# EAGLE design IO-Board (EAGLE 7.4.0)

## Sheet 1 of 5: Verbinder
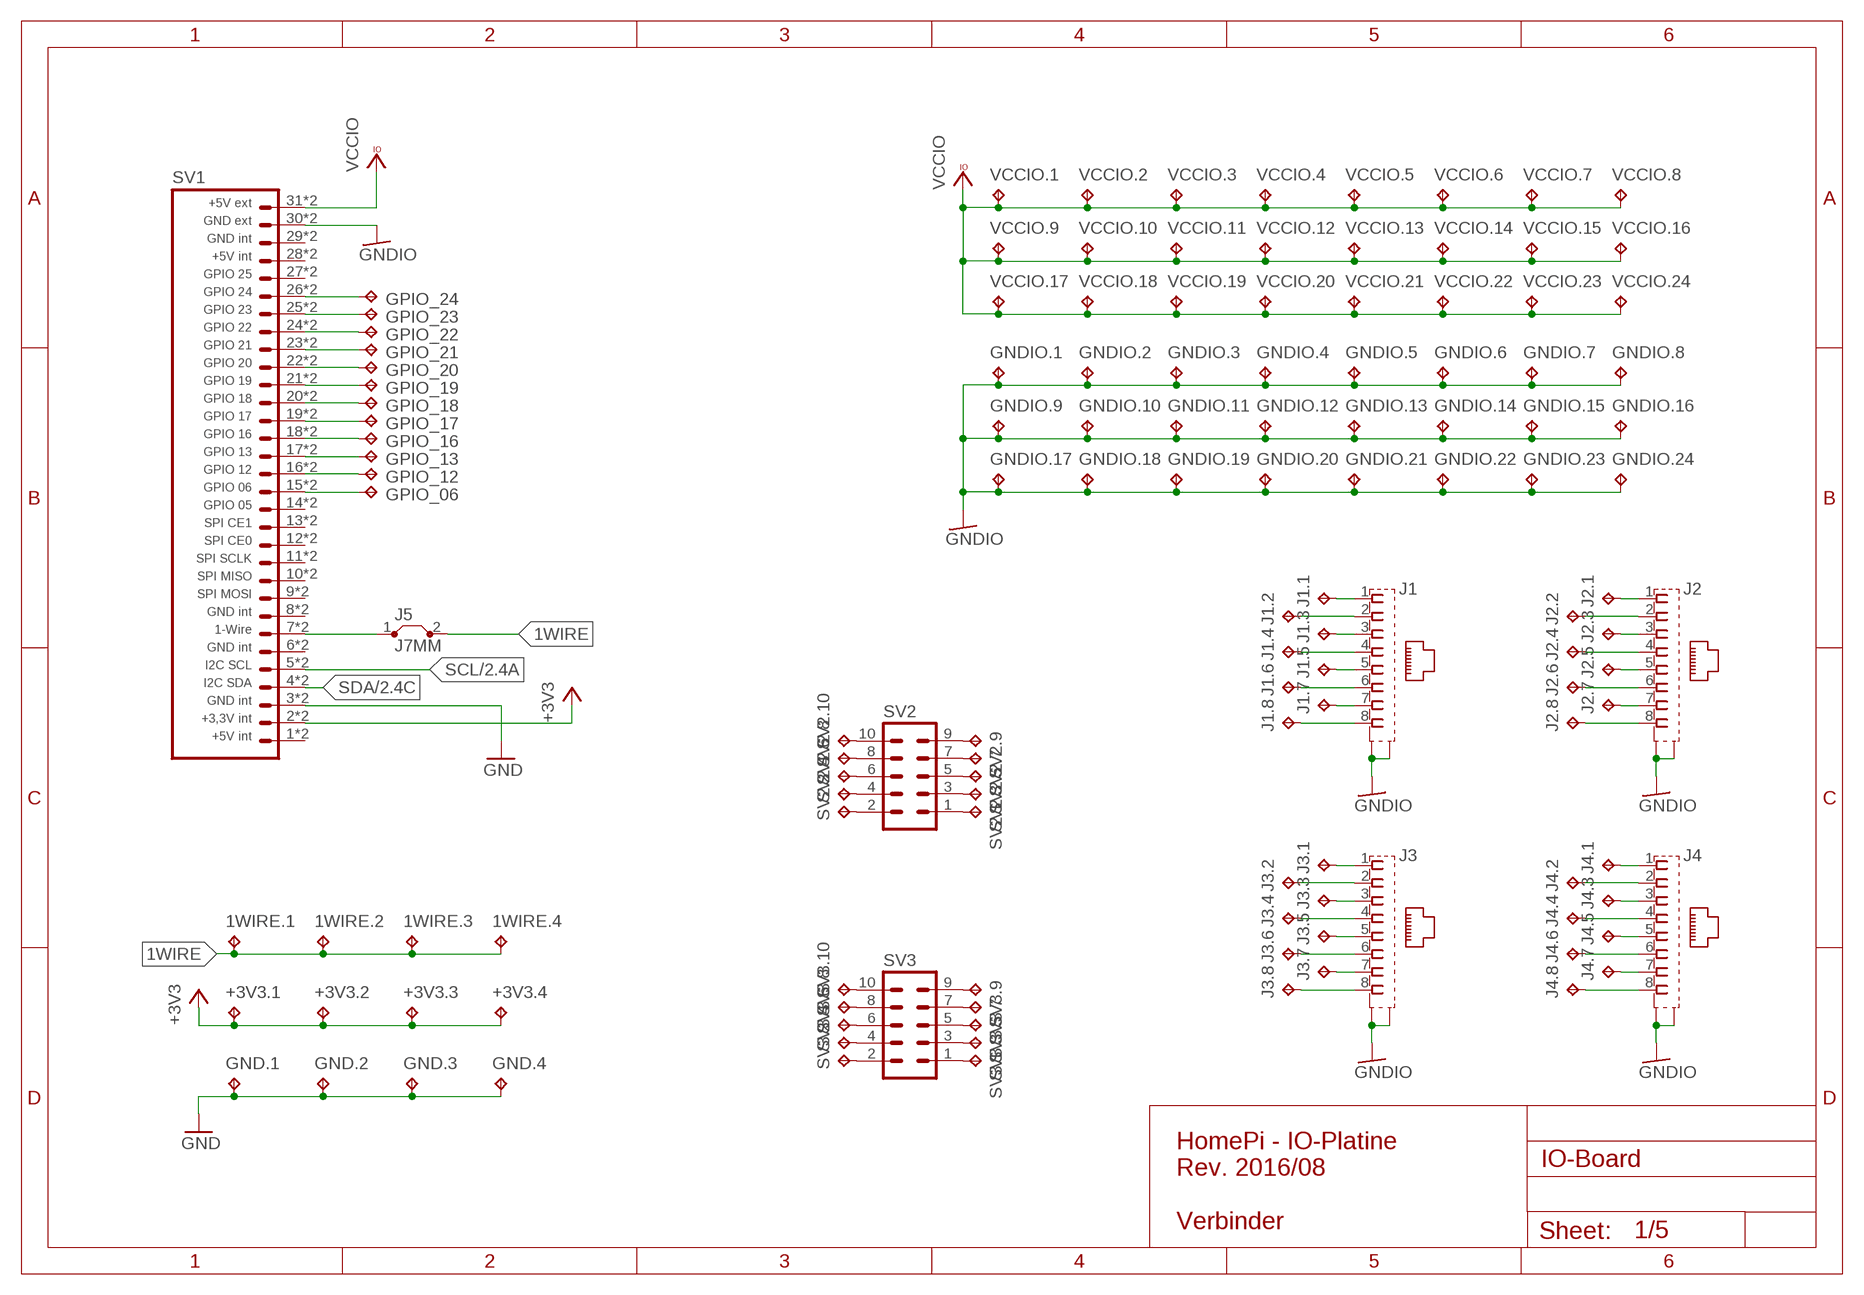
[diagram p0: schematic, sheet 1]

### Parts
1WIRE.1  TPPAD1-13  [P1-13]
1WIRE.2  TPPAD1-13  [P1-13]
1WIRE.3  TPPAD1-13  [P1-13]
1WIRE.4  TPPAD1-13  [P1-13]
+3V3.1  TPPAD1-13  [P1-13]
+3V3.2  TPPAD1-13  [P1-13]
+3V3.3  TPPAD1-13  [P1-13]
+3V3.4  TPPAD1-13  [P1-13]
GND.1  TPPAD1-13  [P1-13]
GND.2  TPPAD1-13  [P1-13]
GND.3  TPPAD1-13  [P1-13]
GND.4  TPPAD1-13  [P1-13]
GNDIO.1  TPPAD1-13  [P1-13]
GNDIO.2  TPPAD1-13  [P1-13]
GNDIO.3  TPPAD1-13  [P1-13]
GNDIO.4  TPPAD1-13  [P1-13]
GNDIO.5  TPPAD1-13  [P1-13]
GNDIO.6  TPPAD1-13  [P1-13]
GNDIO.7  TPPAD1-13  [P1-13]
GNDIO.8  TPPAD1-13  [P1-13]
GNDIO.9  TPPAD1-13  [P1-13]
GNDIO.10  TPPAD1-13  [P1-13]
GNDIO.11  TPPAD1-13  [P1-13]
GNDIO.12  TPPAD1-13  [P1-13]
GNDIO.13  TPPAD1-13  [P1-13]
GNDIO.14  TPPAD1-13  [P1-13]
GNDIO.15  TPPAD1-13  [P1-13]
GNDIO.16  TPPAD1-13  [P1-13]
GNDIO.17  TPPAD1-13  [P1-13]
GNDIO.18  TPPAD1-13  [P1-13]
GNDIO.19  TPPAD1-13  [P1-13]
GNDIO.20  TPPAD1-13  [P1-13]
GNDIO.21  TPPAD1-13  [P1-13]
GNDIO.22  TPPAD1-13  [P1-13]
GNDIO.23  TPPAD1-13  [P1-13]
GNDIO.24  TPPAD1-13  [P1-13]
GPIO_06  TPPAD1-13  [P1-13]
GPIO_12  TPPAD1-13  [P1-13]
GPIO_13  TPPAD1-13  [P1-13]
GPIO_16  TPPAD1-13  [P1-13]
GPIO_17  TPPAD1-13  [P1-13]
GPIO_18  TPPAD1-13  [P1-13]
GPIO_19  TPPAD1-13  [P1-13]
GPIO_20  TPPAD1-13  [P1-13]
GPIO_21  TPPAD1-13  [P1-13]
GPIO_22  TPPAD1-13  [P1-13]
GPIO_23  TPPAD1-13  [P1-13]
GPIO_24  TPPAD1-13  [P1-13]
J1  555141-1  [555153-1]
J1.1  TPPAD1-13  [P1-13]
J1.2  TPPAD1-13  [P1-13]
J1.3  TPPAD1-13  [P1-13]
J1.4  TPPAD1-13  [P1-13]
J1.5  TPPAD1-13  [P1-13]
J1.6  TPPAD1-13  [P1-13]
J1.7  TPPAD1-13  [P1-13]
J1.8  TPPAD1-13  [P1-13]
J2  555141-1  [555153-1]
J2.1  TPPAD1-13  [P1-13]
J2.2  TPPAD1-13  [P1-13]
J2.3  TPPAD1-13  [P1-13]
J2.4  TPPAD1-13  [P1-13]
J2.5  TPPAD1-13  [P1-13]
J2.6  TPPAD1-13  [P1-13]
J2.7  TPPAD1-13  [P1-13]
J2.8  TPPAD1-13  [P1-13]
J3  555141-1  [555153-1]
J3.1  TPPAD1-13  [P1-13]
J3.2  TPPAD1-13  [P1-13]
J3.3  TPPAD1-13  [P1-13]
J3.4  TPPAD1-13  [P1-13]
J3.5  TPPAD1-13  [P1-13]
J3.6  TPPAD1-13  [P1-13]
J3.7  TPPAD1-13  [P1-13]
J3.8  TPPAD1-13  [P1-13]
J4  555141-1  [555153-1]
J4.1  TPPAD1-13  [P1-13]
J4.2  TPPAD1-13  [P1-13]
J4.3  TPPAD1-13  [P1-13]
J4.4  TPPAD1-13  [P1-13]
J4.5  TPPAD1-13  [P1-13]
J4.6  TPPAD1-13  [P1-13]
J4.7  TPPAD1-13  [P1-13]
J4.8  TPPAD1-13  [P1-13]
J5  J7MM  [07]
SV1  PLATINENVERBINDER-31SMD  [PLATINENVERBINDER-31-SMD]
SV2  ML10  [ML10]
SV2.1  TPPAD1-13  [P1-13]
SV2.2  TPPAD1-13  [P1-13]
SV2.3  TPPAD1-13  [P1-13]
SV2.4  TPPAD1-13  [P1-13]
SV2.5  TPPAD1-13  [P1-13]
SV2.6  TPPAD1-13  [P1-13]
SV2.7  TPPAD1-13  [P1-13]
SV2.8  TPPAD1-13  [P1-13]
SV2.9  TPPAD1-13  [P1-13]
SV2.10  TPPAD1-13  [P1-13]
SV3  ML10  [ML10]
SV3.1  TPPAD1-13  [P1-13]
SV3.2  TPPAD1-13  [P1-13]
SV3.3  TPPAD1-13  [P1-13]
SV3.4  TPPAD1-13  [P1-13]
SV3.5  TPPAD1-13  [P1-13]
SV3.6  TPPAD1-13  [P1-13]
SV3.7  TPPAD1-13  [P1-13]
SV3.8  TPPAD1-13  [P1-13]
SV3.9  TPPAD1-13  [P1-13]
SV3.10  TPPAD1-13  [P1-13]
VCCIO.1  TPPAD1-13  [P1-13]
VCCIO.2  TPPAD1-13  [P1-13]
VCCIO.3  TPPAD1-13  [P1-13]
VCCIO.4  TPPAD1-13  [P1-13]
VCCIO.5  TPPAD1-13  [P1-13]
VCCIO.6  TPPAD1-13  [P1-13]
VCCIO.7  TPPAD1-13  [P1-13]
VCCIO.8  TPPAD1-13  [P1-13]
VCCIO.9  TPPAD1-13  [P1-13]
VCCIO.10  TPPAD1-13  [P1-13]
VCCIO.11  TPPAD1-13  [P1-13]
VCCIO.12  TPPAD1-13  [P1-13]
VCCIO.13  TPPAD1-13  [P1-13]
VCCIO.14  TPPAD1-13  [P1-13]
VCCIO.15  TPPAD1-13  [P1-13]
VCCIO.16  TPPAD1-13  [P1-13]
VCCIO.17  TPPAD1-13  [P1-13]
VCCIO.18  TPPAD1-13  [P1-13]
VCCIO.19  TPPAD1-13  [P1-13]
VCCIO.20  TPPAD1-13  [P1-13]
VCCIO.21  TPPAD1-13  [P1-13]
VCCIO.22  TPPAD1-13  [P1-13]
VCCIO.23  TPPAD1-13  [P1-13]
VCCIO.24  TPPAD1-13  [P1-13]

### Nets
1WIRE: 1WIRE.1.TP 1WIRE.2.TP 1WIRE.3.TP 1WIRE.4.TP J5.2
+3V3: +3V3.1.TP +3V3.2.TP +3V3.3.TP +3V3.4.TP SV1.2 SV1.2T ; also sheet 2,3,4
GND: GND.1.TP GND.2.TP GND.3.TP GND.4.TP SV1.3 SV1.3T ; also sheet 2,5
GNDIO: GNDIO.1.TP GNDIO.2.TP GNDIO.3.TP GNDIO.4.TP GNDIO.5.TP GNDIO.6.TP GNDIO.7.TP GNDIO.8.TP GNDIO.9.TP GNDIO.10.TP GNDIO.11.TP GNDIO.12.TP GNDIO.13.TP GNDIO.14.TP GNDIO.15.TP GNDIO.16.TP GNDIO.17.TP GNDIO.18.TP GNDIO.19.TP GNDIO.20.TP GNDIO.21.TP GNDIO.22.TP GNDIO.23.TP GNDIO.24.TP J1.G1(S1) J1.G2(S2) J2.G1(S1) J2.G2(S2) J3.G1(S1) J3.G2(S2) J4.G1(S1) J4.G2(S2) SV1.30 SV1.30T ; also sheet 3,4
N$36: J1.1 J1.1.TP
N$37: J1.2 J1.2.TP
N$38: J1.3 J1.3.TP
N$39: J1.4 J1.4.TP
N$40: J1.5 J1.5.TP
N$41: J1.6 J1.6.TP
N$42: J1.7 J1.7.TP
N$43: J1.8 J1.8.TP
N$44: J2.1 J2.1.TP
N$45: J2.2 J2.2.TP
N$46: J2.3 J2.3.TP
N$47: J2.4 J2.4.TP
N$48: J2.5 J2.5.TP
N$49: J2.6 J2.6.TP
N$50: J2.7 J2.7.TP
N$51: J2.8 J2.8.TP
N$129: J3.1 J3.1.TP
N$130: J3.2 J3.2.TP
N$131: J3.3 J3.3.TP
N$132: J3.4 J3.4.TP
N$133: J3.5 J3.5.TP
N$134: J3.6 J3.6.TP
N$135: J3.7 J3.7.TP
N$136: J3.8 J3.8.TP
N$137: J4.1 J4.1.TP
N$138: J4.2 J4.2.TP
N$139: J4.3 J4.3.TP
N$140: J4.4 J4.4.TP
N$141: J4.5 J4.5.TP
N$142: J4.6 J4.6.TP
N$143: J4.7 J4.7.TP
N$144: J4.8 J4.8.TP
N$145: J5.1 SV1.7 SV1.7T
N$146: GPIO_23.TP SV1.25 SV1.25T
N$147: GPIO_22.TP SV1.24 SV1.24T
N$148: GPIO_21.TP SV1.23 SV1.23T
N$149: GPIO_20.TP SV1.22 SV1.22T
N$150: GPIO_19.TP SV1.21 SV1.21T
N$151: GPIO_18.TP SV1.20 SV1.20T
N$152: GPIO_17.TP SV1.19 SV1.19T
N$153: GPIO_16.TP SV1.18 SV1.18T
N$154: GPIO_13.TP SV1.17 SV1.17T
N$155: GPIO_12.TP SV1.16 SV1.16T
N$156: GPIO_06.TP SV1.15 SV1.15T
N$157: SV2.1 SV2.1.TP
N$158: SV2.2 SV2.2.TP
N$159: SV2.3 SV2.3.TP
N$160: SV2.4 SV2.4.TP
N$161: SV2.5 SV2.5.TP
N$162: SV2.6 SV2.6.TP
N$163: SV2.7 SV2.7.TP
N$164: SV2.8 SV2.8.TP
N$165: SV2.9 SV2.9.TP
N$166: SV2.10 SV2.10.TP
N$167: SV3.1 SV3.1.TP
N$168: SV3.2 SV3.2.TP
N$169: SV3.3 SV3.3.TP
N$170: SV3.4 SV3.4.TP
N$171: SV3.5 SV3.5.TP
N$172: SV3.6 SV3.6.TP
N$173: SV3.7 SV3.7.TP
N$174: SV3.8 SV3.8.TP
N$175: SV3.9 SV3.9.TP
N$176: SV3.10 SV3.10.TP
N$177: GPIO_24.TP SV1.26 SV1.26T
SCL: SV1.5 SV1.5T ; also sheet 2
SDA: SV1.4 SV1.4T ; also sheet 2
VCCIO: SV1.31 SV1.31T VCCIO.1.TP VCCIO.2.TP VCCIO.3.TP VCCIO.4.TP VCCIO.5.TP VCCIO.6.TP VCCIO.7.TP VCCIO.8.TP VCCIO.9.TP VCCIO.10.TP VCCIO.11.TP VCCIO.12.TP VCCIO.13.TP VCCIO.14.TP VCCIO.15.TP VCCIO.16.TP VCCIO.17.TP VCCIO.18.TP VCCIO.19.TP VCCIO.20.TP VCCIO.21.TP VCCIO.22.TP VCCIO.23.TP VCCIO.24.TP ; also sheet 3,4,5
Unconnected: SV1.1 SV1.1T SV1.6 SV1.6T SV1.8 SV1.8T SV1.9 SV1.9T SV1.10 SV1.10T SV1.11 SV1.11T SV1.12 SV1.12T SV1.13 SV1.13T SV1.14 SV1.14T SV1.27 SV1.27T SV1.28 SV1.28T SV1.29 SV1.29T

### Notes on the sheet
- HomePi - IO-Platine
  Rev. 2016/08
  
  Verbinder

## Sheet 2 of 5: ICs
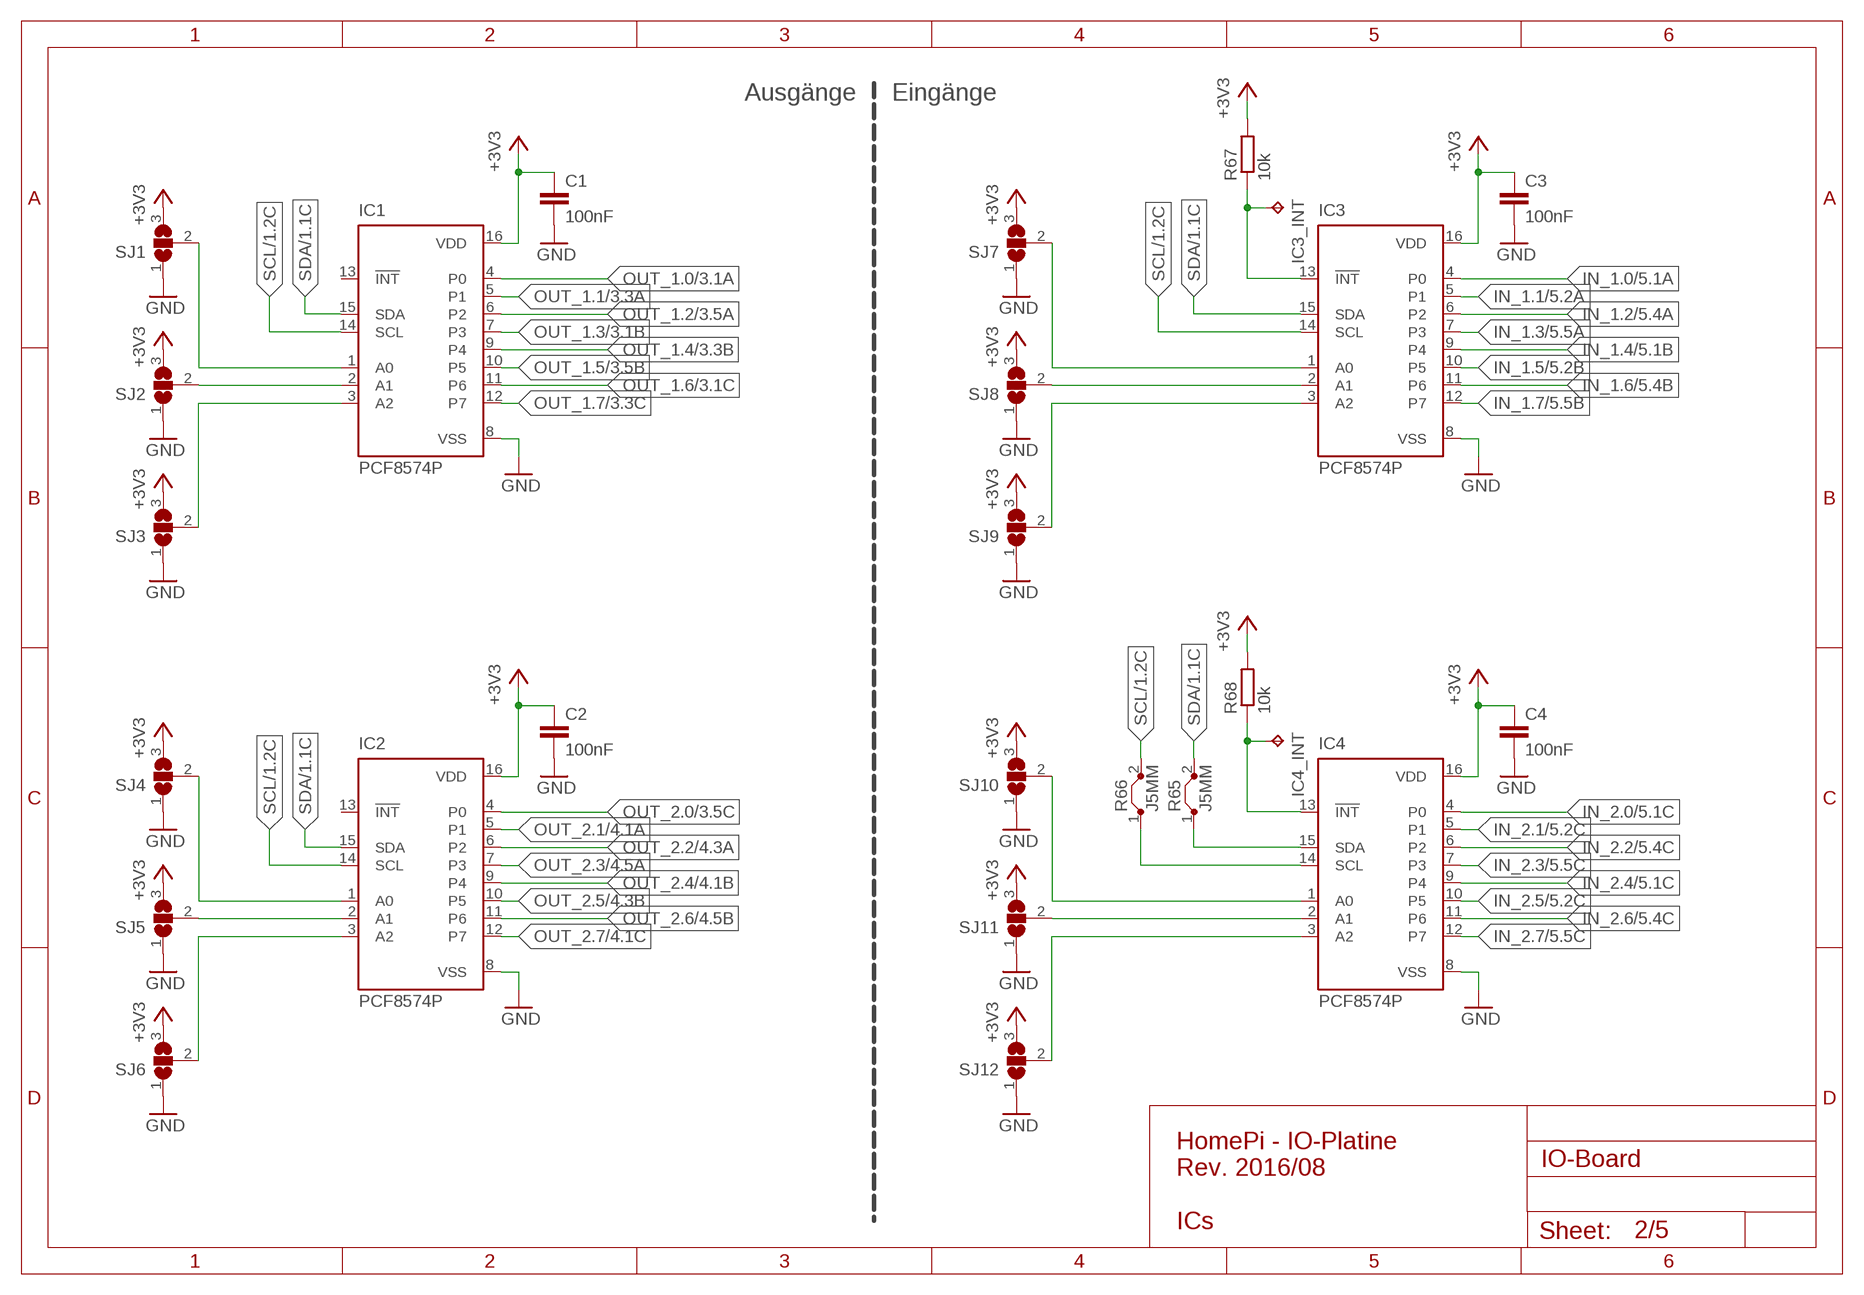
[diagram p1: schematic, sheet 2]

### Parts
C1  100nF  C-EU025-025X050  [C025-025X050]
C2  100nF  C-EU025-025X050  [C025-025X050]
C3  100nF  C-EU025-025X050  [C025-025X050]
C4  100nF  C-EU025-025X050  [C025-025X050]
IC1  PCF8574P  [DIL16]
IC2  PCF8574P  [DIL16]
IC3  PCF8574P  [DIL16]
IC3_INT  TPPAD1-13  [P1-13]
IC4  PCF8574P  [DIL16]
IC4_INT  TPPAD1-13  [P1-13]
R65  J5MM  [05]
R66  J5MM  [05]
R67  10k  R-EU_0204/2V  [0204V]
R68  10k  R-EU_0204/2V  [0204V]
SJ1  SJ2W  [SJ_2]
SJ2  SJ2W  [SJ_2]
SJ3  SJ2W  [SJ_2]
SJ4  SJ2W  [SJ_2]
SJ5  SJ2W  [SJ_2]
SJ6  SJ2W  [SJ_2]
SJ7  SJ2W  [SJ_2]
SJ8  SJ2W  [SJ_2]
SJ9  SJ2W  [SJ_2]
SJ10  SJ2W  [SJ_2]
SJ11  SJ2W  [SJ_2]
SJ12  SJ2W  [SJ_2]

### Nets
+3V3: C1.1 C2.1 C3.1 C4.1 IC1.16(VDD) IC2.16(VDD) IC3.16(VDD) IC4.16(VDD) R67.2 R68.2 SJ1.3 SJ2.3 SJ3.3 SJ4.3 SJ5.3 SJ6.3 SJ7.3 SJ8.3 SJ9.3 SJ10.3 SJ11.3 SJ12.3 ; also sheet 1,3,4
GND: C1.2 C2.2 C3.2 C4.2 IC1.8(VSS) IC2.8(VSS) IC3.8(VSS) IC4.8(VSS) SJ1.1 SJ2.1 SJ3.1 SJ4.1 SJ5.1 SJ6.1 SJ7.1 SJ8.1 SJ9.1 SJ10.1 SJ11.1 SJ12.1 ; also sheet 1,5
IN_1.0: IC3.4(P0) ; also sheet 5
IN_1.1: IC3.5(P1) ; also sheet 5
IN_1.2: IC3.6(P2) ; also sheet 5
IN_1.3: IC3.7(P3) ; also sheet 5
IN_1.4: IC3.9(P4) ; also sheet 5
IN_1.5: IC3.10(P5) ; also sheet 5
IN_1.6: IC3.11(P6) ; also sheet 5
IN_1.7: IC3.12(P7) ; also sheet 5
IN_2.0: IC4.4(P0) ; also sheet 5
IN_2.1: IC4.5(P1) ; also sheet 5
IN_2.2: IC4.6(P2) ; also sheet 5
IN_2.3: IC4.7(P3) ; also sheet 5
IN_2.4: IC4.9(P4) ; also sheet 5
IN_2.5: IC4.10(P5) ; also sheet 5
IN_2.6: IC4.11(P6) ; also sheet 5
IN_2.7: IC4.12(P7) ; also sheet 5
N$1: IC1.1(A0) SJ1.2
N$2: IC1.2(A1) SJ2.2
N$3: IC1.3(A2) SJ3.2
N$84: IC2.1(A0) SJ4.2
N$85: IC2.2(A1) SJ5.2
N$86: IC2.3(A2) SJ6.2
N$87: IC3.1(A0) SJ7.2
N$88: IC3.2(A1) SJ8.2
N$89: IC3.3(A2) SJ9.2
N$106: IC3.13(!INT) IC3_INT.TP R67.1
N$107: IC4.1(A0) SJ10.2
N$108: IC4.2(A1) SJ11.2
N$109: IC4.3(A2) SJ12.2
N$126: IC4.13(!INT) IC4_INT.TP R68.1
N$127: IC4.15(SDA) R65.1
N$128: IC4.14(SCL) R66.1
OUT_1.0: IC1.4(P0) ; also sheet 3
OUT_1.1: IC1.5(P1) ; also sheet 3
OUT_1.2: IC1.6(P2) ; also sheet 3
OUT_1.3: IC1.7(P3) ; also sheet 3
OUT_1.4: IC1.9(P4) ; also sheet 3
OUT_1.5: IC1.10(P5) ; also sheet 3
OUT_1.6: IC1.11(P6) ; also sheet 3
OUT_1.7: IC1.12(P7) ; also sheet 3
OUT_2.0: IC2.4(P0) ; also sheet 3
OUT_2.1: IC2.5(P1) ; also sheet 4
OUT_2.2: IC2.6(P2) ; also sheet 4
OUT_2.3: IC2.7(P3) ; also sheet 4
OUT_2.4: IC2.9(P4) ; also sheet 4
OUT_2.5: IC2.10(P5) ; also sheet 4
OUT_2.6: IC2.11(P6) ; also sheet 4
OUT_2.7: IC2.12(P7) ; also sheet 4
SCL: IC1.14(SCL) IC2.14(SCL) IC3.14(SCL) R66.2 ; also sheet 1
SDA: IC1.15(SDA) IC2.15(SDA) IC3.15(SDA) R65.2 ; also sheet 1
Unconnected: IC1.13(!INT) IC2.13(!INT)

### Notes on the sheet
- Ausgänge | Eingänge
- HomePi - IO-Platine
  Rev. 2016/08
  
  ICs

## Sheet 3 of 5: Ausgänge
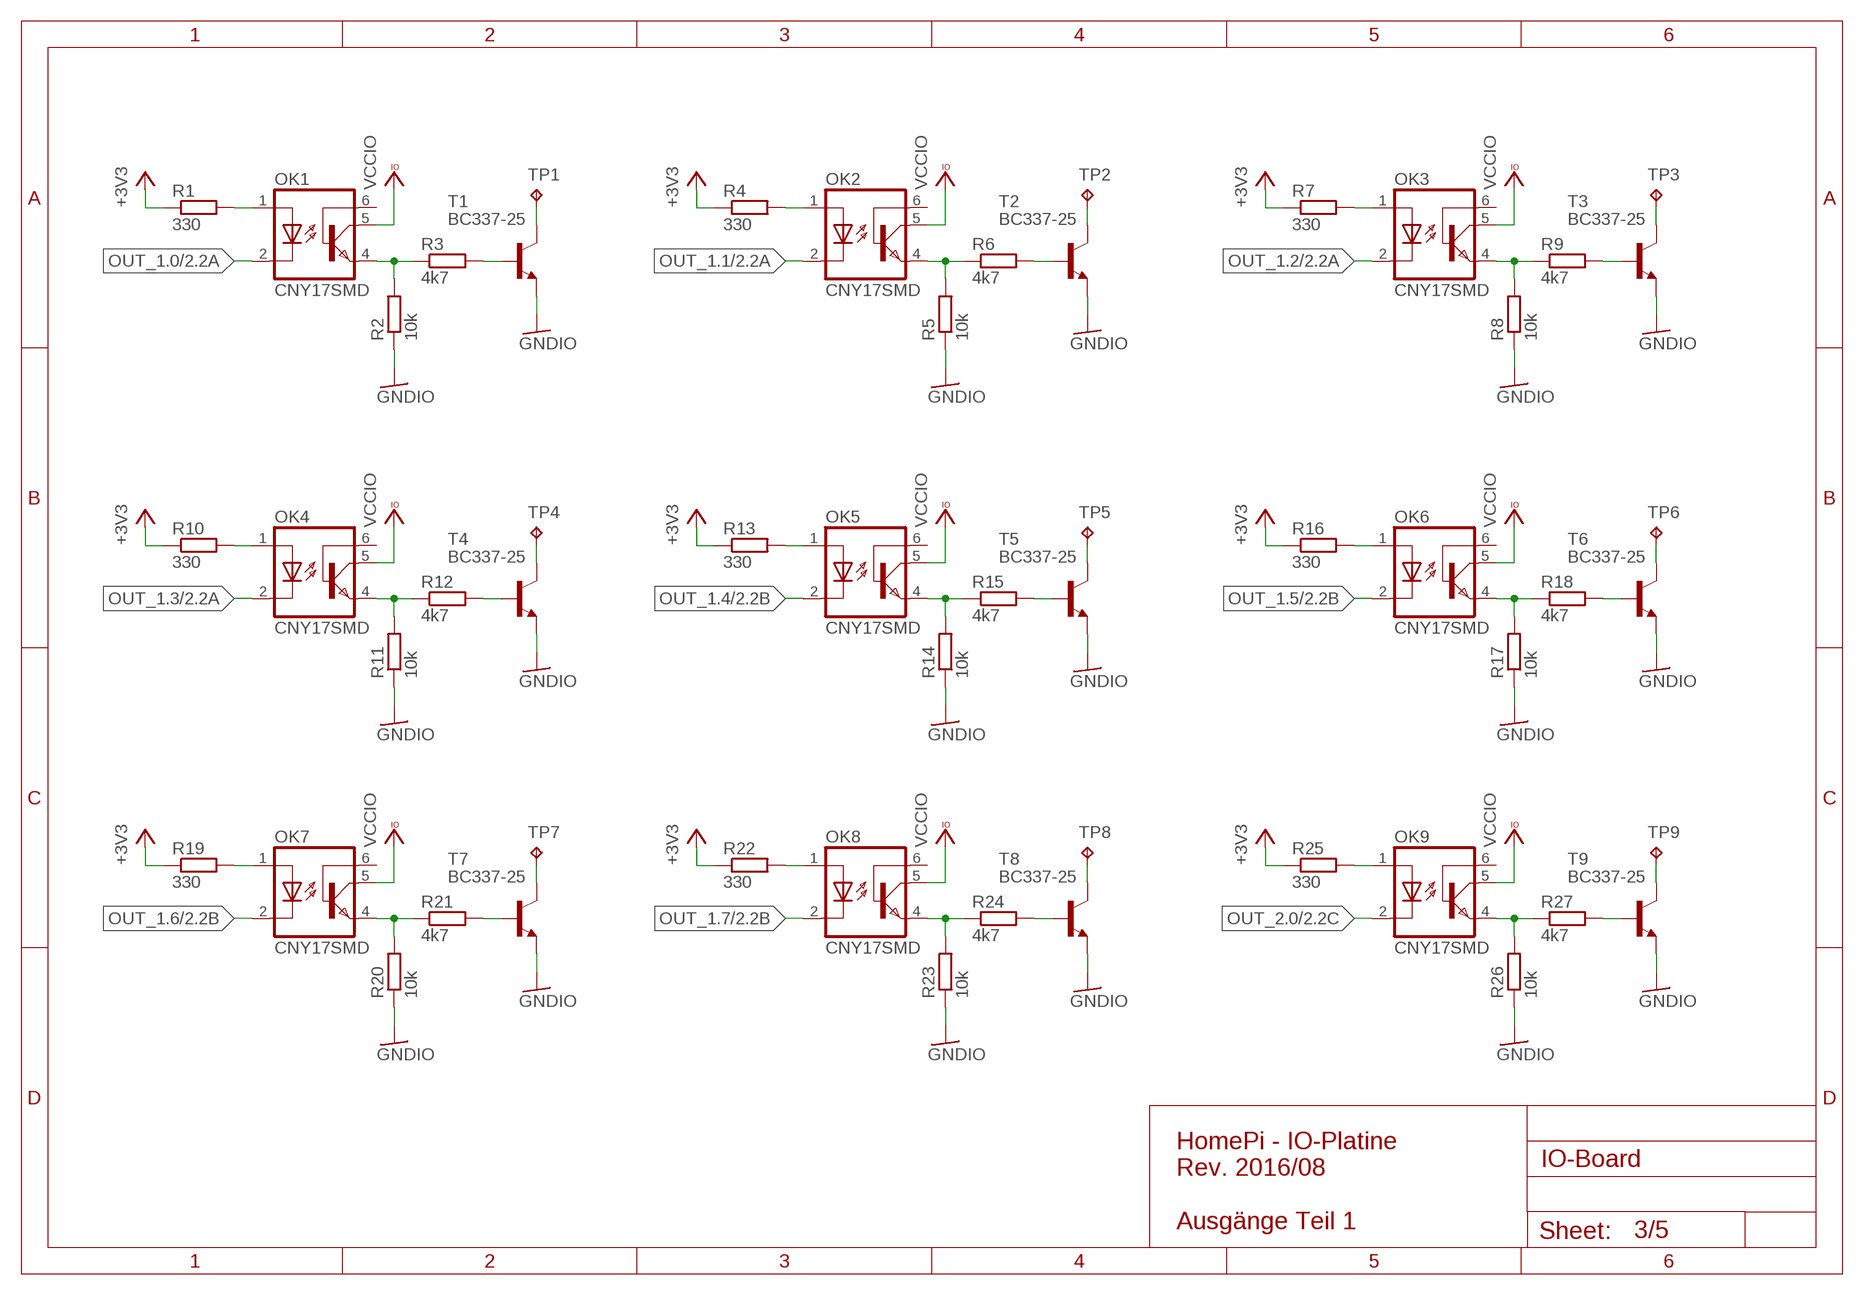
[diagram p2: schematic, sheet 3]

### Parts
OK1  CNY17SMD  [DIL06_SMD]
OK2  CNY17SMD  [DIL06_SMD]
OK3  CNY17SMD  [DIL06_SMD]
OK4  CNY17SMD  [DIL06_SMD]
OK5  CNY17SMD  [DIL06_SMD]
OK6  CNY17SMD  [DIL06_SMD]
OK7  CNY17SMD  [DIL06_SMD]
OK8  CNY17SMD  [DIL06_SMD]
OK9  CNY17SMD  [DIL06_SMD]
R1  330  R-EU_0204/2V  [0204V]
R2  10k  R-EU_0204/2V  [0204V]
R3  4k7  R-EU_0204/2V  [0204V]
R4  330  R-EU_0204/2V  [0204V]
R5  10k  R-EU_0204/2V  [0204V]
R6  4k7  R-EU_0204/2V  [0204V]
R7  330  R-EU_0204/2V  [0204V]
R8  10k  R-EU_0204/2V  [0204V]
R9  4k7  R-EU_0204/2V  [0204V]
R10  330  R-EU_0204/2V  [0204V]
R11  10k  R-EU_0204/2V  [0204V]
R12  4k7  R-EU_0204/2V  [0204V]
R13  330  R-EU_0204/2V  [0204V]
R14  10k  R-EU_0204/2V  [0204V]
R15  4k7  R-EU_0204/2V  [0204V]
R16  330  R-EU_0204/2V  [0204V]
R17  10k  R-EU_0204/2V  [0204V]
R18  4k7  R-EU_0204/2V  [0204V]
R19  330  R-EU_0204/2V  [0204V]
R20  10k  R-EU_0204/2V  [0204V]
R21  4k7  R-EU_0204/2V  [0204V]
R22  330  R-EU_0204/2V  [0204V]
R23  10k  R-EU_0204/2V  [0204V]
R24  4k7  R-EU_0204/2V  [0204V]
R25  330  R-EU_0204/2V  [0204V]
R26  10k  R-EU_0204/2V  [0204V]
R27  4k7  R-EU_0204/2V  [0204V]
T1  BC337-25  BC337-25-NPN-TO92-CBE  [TO92-CBE]
T2  BC337-25  BC337-25-NPN-TO92-CBE  [TO92-CBE]
T3  BC337-25  BC337-25-NPN-TO92-CBE  [TO92-CBE]
T4  BC337-25  BC337-25-NPN-TO92-CBE  [TO92-CBE]
T5  BC337-25  BC337-25-NPN-TO92-CBE  [TO92-CBE]
T6  BC337-25  BC337-25-NPN-TO92-CBE  [TO92-CBE]
T7  BC337-25  BC337-25-NPN-TO92-CBE  [TO92-CBE]
T8  BC337-25  BC337-25-NPN-TO92-CBE  [TO92-CBE]
T9  BC337-25  BC337-25-NPN-TO92-CBE  [TO92-CBE]
TP1  TPPAD1-13  [P1-13]
TP2  TPPAD1-13  [P1-13]
TP3  TPPAD1-13  [P1-13]
TP4  TPPAD1-13  [P1-13]
TP5  TPPAD1-13  [P1-13]
TP6  TPPAD1-13  [P1-13]
TP7  TPPAD1-13  [P1-13]
TP8  TPPAD1-13  [P1-13]
TP9  TPPAD1-13  [P1-13]

### Nets
+3V3: R1.1 R4.1 R7.1 R10.1 R13.1 R16.1 R19.1 R22.1 R25.1 ; also sheet 1,2,4
GNDIO: R2.1 R5.1 R8.1 R11.1 R14.1 R17.1 R20.1 R23.1 R26.1 T1.E T2.E T3.E T4.E T5.E T6.E T7.E T8.E T9.E ; also sheet 1,4
N$4: T1.C TP1.TP
N$5: OK1.1(A) R1.2
N$6: OK1.4(EMI) R2.2 R3.1
N$7: R3.2 T1.B
N$8: T2.C TP2.TP
N$9: OK2.1(A) R4.2
N$10: OK2.4(EMI) R5.2 R6.1
N$11: R6.2 T2.B
N$12: T3.C TP3.TP
N$13: OK3.1(A) R7.2
N$14: OK3.4(EMI) R8.2 R9.1
N$15: R9.2 T3.B
N$16: T4.C TP4.TP
N$17: OK4.1(A) R10.2
N$18: OK4.4(EMI) R11.2 R12.1
N$19: R12.2 T4.B
N$20: T5.C TP5.TP
N$21: OK5.1(A) R13.2
N$22: OK5.4(EMI) R14.2 R15.1
N$23: R15.2 T5.B
N$24: T6.C TP6.TP
N$25: OK6.1(A) R16.2
N$26: OK6.4(EMI) R17.2 R18.1
N$27: R18.2 T6.B
N$28: T7.C TP7.TP
N$29: OK7.1(A) R19.2
N$30: OK7.4(EMI) R20.2 R21.1
N$31: R21.2 T7.B
N$32: T8.C TP8.TP
N$33: OK8.1(A) R22.2
N$34: OK8.4(EMI) R23.2 R24.1
N$35: R24.2 T8.B
N$52: T9.C TP9.TP
N$53: OK9.1(A) R25.2
N$54: OK9.4(EMI) R26.2 R27.1
N$55: R27.2 T9.B
OUT_1.0: OK1.2(C) ; also sheet 2
OUT_1.1: OK2.2(C) ; also sheet 2
OUT_1.2: OK3.2(C) ; also sheet 2
OUT_1.3: OK4.2(C) ; also sheet 2
OUT_1.4: OK5.2(C) ; also sheet 2
OUT_1.5: OK6.2(C) ; also sheet 2
OUT_1.6: OK7.2(C) ; also sheet 2
OUT_1.7: OK8.2(C) ; also sheet 2
OUT_2.0: OK9.2(C) ; also sheet 2
VCCIO: OK1.5(COL) OK2.5(COL) OK3.5(COL) OK4.5(COL) OK5.5(COL) OK6.5(COL) OK7.5(COL) OK8.5(COL) OK9.5(COL) ; also sheet 1,4,5
Unconnected: OK1.6(BAS) OK2.6(BAS) OK3.6(BAS) OK4.6(BAS) OK5.6(BAS) OK6.6(BAS) OK7.6(BAS) OK8.6(BAS) OK9.6(BAS)

### Notes on the sheet
- HomePi - IO-Platine
  Rev. 2016/08
  
  Ausgänge Teil 1

## Sheet 4 of 5: Ausgänge
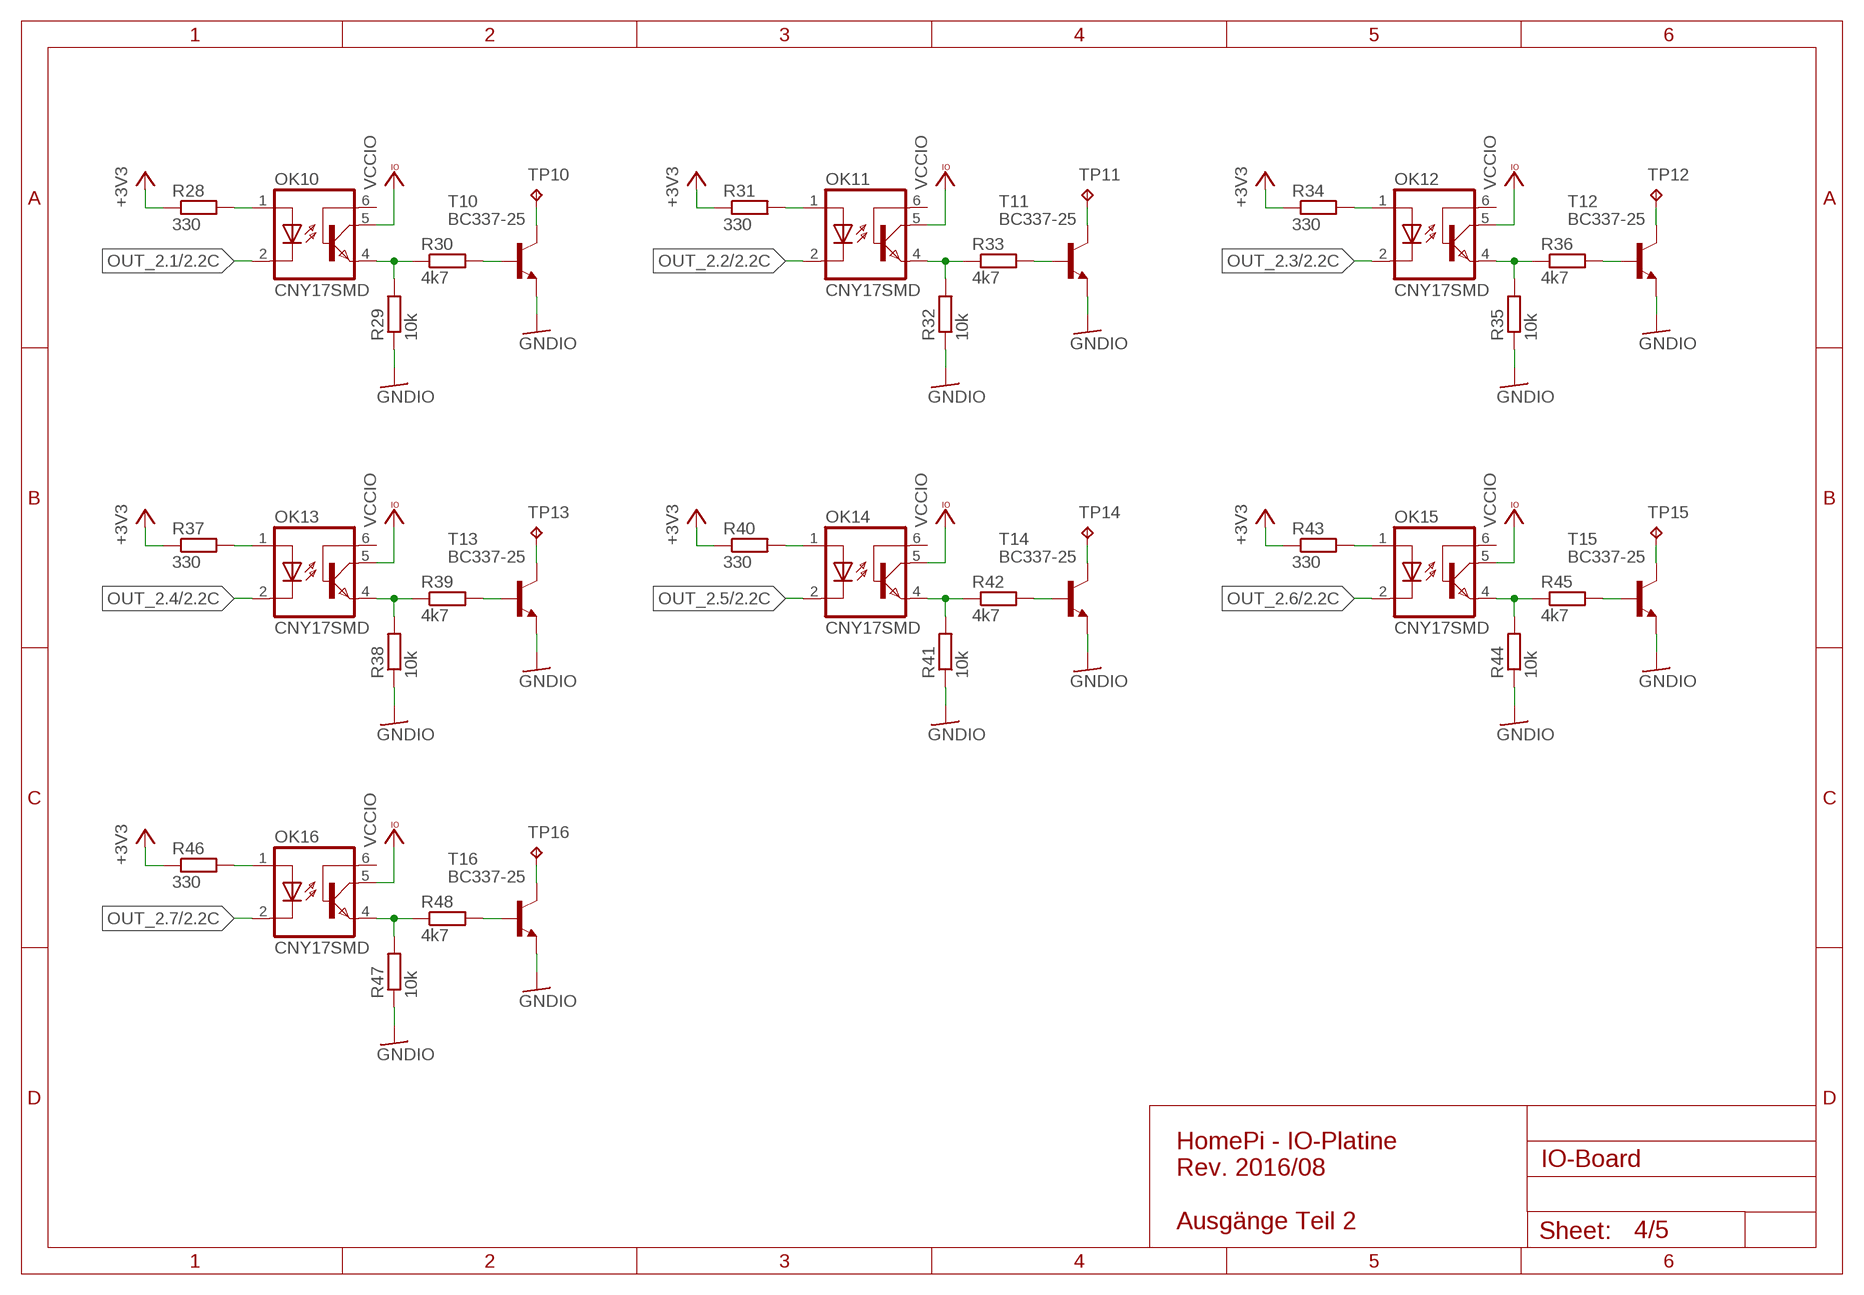
[diagram p3: schematic, sheet 4]

### Parts
OK10  CNY17SMD  [DIL06_SMD]
OK11  CNY17SMD  [DIL06_SMD]
OK12  CNY17SMD  [DIL06_SMD]
OK13  CNY17SMD  [DIL06_SMD]
OK14  CNY17SMD  [DIL06_SMD]
OK15  CNY17SMD  [DIL06_SMD]
OK16  CNY17SMD  [DIL06_SMD]
R28  330  R-EU_0204/2V  [0204V]
R29  10k  R-EU_0204/2V  [0204V]
R30  4k7  R-EU_0204/2V  [0204V]
R31  330  R-EU_0204/2V  [0204V]
R32  10k  R-EU_0204/2V  [0204V]
R33  4k7  R-EU_0204/2V  [0204V]
R34  330  R-EU_0204/2V  [0204V]
R35  10k  R-EU_0204/2V  [0204V]
R36  4k7  R-EU_0204/2V  [0204V]
R37  330  R-EU_0204/2V  [0204V]
R38  10k  R-EU_0204/2V  [0204V]
R39  4k7  R-EU_0204/2V  [0204V]
R40  330  R-EU_0204/2V  [0204V]
R41  10k  R-EU_0204/2V  [0204V]
R42  4k7  R-EU_0204/2V  [0204V]
R43  330  R-EU_0204/2V  [0204V]
R44  10k  R-EU_0204/2V  [0204V]
R45  4k7  R-EU_0204/2V  [0204V]
R46  330  R-EU_0204/2V  [0204V]
R47  10k  R-EU_0204/2V  [0204V]
R48  4k7  R-EU_0204/2V  [0204V]
T10  BC337-25  BC337-25-NPN-TO92-CBE  [TO92-CBE]
T11  BC337-25  BC337-25-NPN-TO92-CBE  [TO92-CBE]
T12  BC337-25  BC337-25-NPN-TO92-CBE  [TO92-CBE]
T13  BC337-25  BC337-25-NPN-TO92-CBE  [TO92-CBE]
T14  BC337-25  BC337-25-NPN-TO92-CBE  [TO92-CBE]
T15  BC337-25  BC337-25-NPN-TO92-CBE  [TO92-CBE]
T16  BC337-25  BC337-25-NPN-TO92-CBE  [TO92-CBE]
TP10  TPPAD1-13  [P1-13]
TP11  TPPAD1-13  [P1-13]
TP12  TPPAD1-13  [P1-13]
TP13  TPPAD1-13  [P1-13]
TP14  TPPAD1-13  [P1-13]
TP15  TPPAD1-13  [P1-13]
TP16  TPPAD1-13  [P1-13]

### Nets
+3V3: R28.1 R31.1 R34.1 R37.1 R40.1 R43.1 R46.1 ; also sheet 1,2,3
GNDIO: R29.1 R32.1 R35.1 R38.1 R41.1 R44.1 R47.1 T10.E T11.E T12.E T13.E T14.E T15.E T16.E ; also sheet 1,3
N$56: T10.C TP10.TP
N$57: OK10.1(A) R28.2
N$58: OK10.4(EMI) R29.2 R30.1
N$59: R30.2 T10.B
N$60: T11.C TP11.TP
N$61: OK11.1(A) R31.2
N$62: OK11.4(EMI) R32.2 R33.1
N$63: R33.2 T11.B
N$64: T12.C TP12.TP
N$65: OK12.1(A) R34.2
N$66: OK12.4(EMI) R35.2 R36.1
N$67: R36.2 T12.B
N$68: T13.C TP13.TP
N$69: OK13.1(A) R37.2
N$70: OK13.4(EMI) R38.2 R39.1
N$71: R39.2 T13.B
N$72: T14.C TP14.TP
N$73: OK14.1(A) R40.2
N$74: OK14.4(EMI) R41.2 R42.1
N$75: R42.2 T14.B
N$76: T15.C TP15.TP
N$77: OK15.1(A) R43.2
N$78: OK15.4(EMI) R44.2 R45.1
N$79: R45.2 T15.B
N$80: T16.C TP16.TP
N$81: OK16.1(A) R46.2
N$82: OK16.4(EMI) R47.2 R48.1
N$83: R48.2 T16.B
OUT_2.1: OK10.2(C) ; also sheet 2
OUT_2.2: OK11.2(C) ; also sheet 2
OUT_2.3: OK12.2(C) ; also sheet 2
OUT_2.4: OK13.2(C) ; also sheet 2
OUT_2.5: OK14.2(C) ; also sheet 2
OUT_2.6: OK15.2(C) ; also sheet 2
OUT_2.7: OK16.2(C) ; also sheet 2
VCCIO: OK10.5(COL) OK11.5(COL) OK12.5(COL) OK13.5(COL) OK14.5(COL) OK15.5(COL) OK16.5(COL) ; also sheet 1,3,5
Unconnected: OK10.6(BAS) OK11.6(BAS) OK12.6(BAS) OK13.6(BAS) OK14.6(BAS) OK15.6(BAS) OK16.6(BAS)

### Notes on the sheet
- HomePi - IO-Platine
  Rev. 2016/08
  
  Ausgänge Teil 2

## Sheet 5 of 5: Eingänge
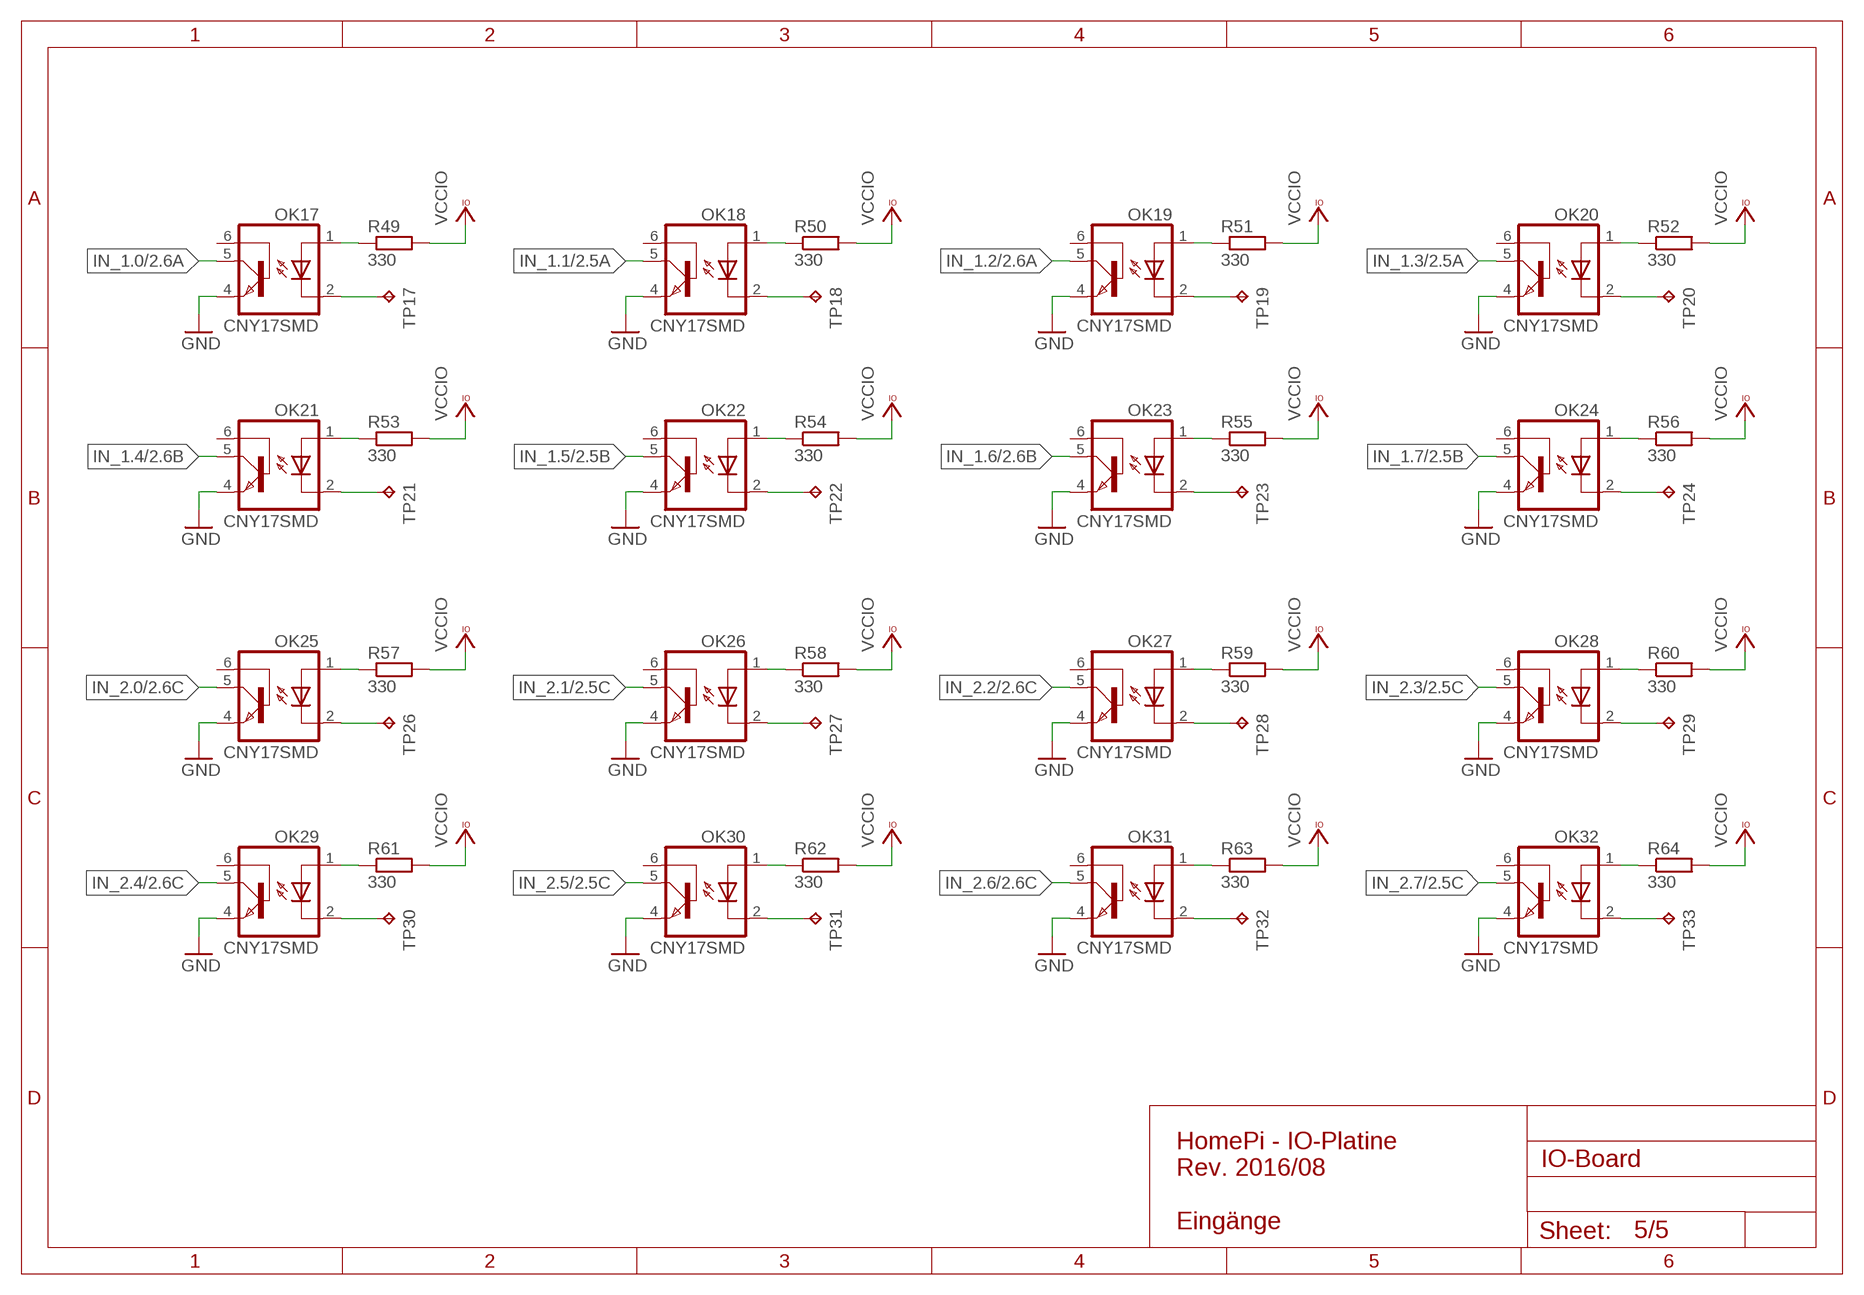
[diagram p4: schematic, sheet 5]

### Parts
OK17  CNY17SMD  [DIL06_SMD]
OK18  CNY17SMD  [DIL06_SMD]
OK19  CNY17SMD  [DIL06_SMD]
OK20  CNY17SMD  [DIL06_SMD]
OK21  CNY17SMD  [DIL06_SMD]
OK22  CNY17SMD  [DIL06_SMD]
OK23  CNY17SMD  [DIL06_SMD]
OK24  CNY17SMD  [DIL06_SMD]
OK25  CNY17SMD  [DIL06_SMD]
OK26  CNY17SMD  [DIL06_SMD]
OK27  CNY17SMD  [DIL06_SMD]
OK28  CNY17SMD  [DIL06_SMD]
OK29  CNY17SMD  [DIL06_SMD]
OK30  CNY17SMD  [DIL06_SMD]
OK31  CNY17SMD  [DIL06_SMD]
OK32  CNY17SMD  [DIL06_SMD]
R49  330  R-EU_0204/2V  [0204V]
R50  330  R-EU_0204/2V  [0204V]
R51  330  R-EU_0204/2V  [0204V]
R52  330  R-EU_0204/2V  [0204V]
R53  330  R-EU_0204/2V  [0204V]
R54  330  R-EU_0204/2V  [0204V]
R55  330  R-EU_0204/2V  [0204V]
R56  330  R-EU_0204/2V  [0204V]
R57  330  R-EU_0204/2V  [0204V]
R58  330  R-EU_0204/2V  [0204V]
R59  330  R-EU_0204/2V  [0204V]
R60  330  R-EU_0204/2V  [0204V]
R61  330  R-EU_0204/2V  [0204V]
R62  330  R-EU_0204/2V  [0204V]
R63  330  R-EU_0204/2V  [0204V]
R64  330  R-EU_0204/2V  [0204V]
TP17  TPPAD1-13  [P1-13]
TP18  TPPAD1-13  [P1-13]
TP19  TPPAD1-13  [P1-13]
TP20  TPPAD1-13  [P1-13]
TP21  TPPAD1-13  [P1-13]
TP22  TPPAD1-13  [P1-13]
TP23  TPPAD1-13  [P1-13]
TP24  TPPAD1-13  [P1-13]
TP26  TPPAD1-13  [P1-13]
TP27  TPPAD1-13  [P1-13]
TP28  TPPAD1-13  [P1-13]
TP29  TPPAD1-13  [P1-13]
TP30  TPPAD1-13  [P1-13]
TP31  TPPAD1-13  [P1-13]
TP32  TPPAD1-13  [P1-13]
TP33  TPPAD1-13  [P1-13]

### Nets
GND: OK17.4(EMI) OK18.4(EMI) OK19.4(EMI) OK20.4(EMI) OK21.4(EMI) OK22.4(EMI) OK23.4(EMI) OK24.4(EMI) OK25.4(EMI) OK26.4(EMI) OK27.4(EMI) OK28.4(EMI) OK29.4(EMI) OK30.4(EMI) OK31.4(EMI) OK32.4(EMI) ; also sheet 1,2
IN_1.0: OK17.5(COL) ; also sheet 2
IN_1.1: OK18.5(COL) ; also sheet 2
IN_1.2: OK19.5(COL) ; also sheet 2
IN_1.3: OK20.5(COL) ; also sheet 2
IN_1.4: OK21.5(COL) ; also sheet 2
IN_1.5: OK22.5(COL) ; also sheet 2
IN_1.6: OK23.5(COL) ; also sheet 2
IN_1.7: OK24.5(COL) ; also sheet 2
IN_2.0: OK25.5(COL) ; also sheet 2
IN_2.1: OK26.5(COL) ; also sheet 2
IN_2.2: OK27.5(COL) ; also sheet 2
IN_2.3: OK28.5(COL) ; also sheet 2
IN_2.4: OK29.5(COL) ; also sheet 2
IN_2.5: OK30.5(COL) ; also sheet 2
IN_2.6: OK31.5(COL) ; also sheet 2
IN_2.7: OK32.5(COL) ; also sheet 2
N$90: OK17.1(A) R49.1
N$91: OK17.2(C) TP17.TP
N$92: OK18.1(A) R50.1
N$93: OK18.2(C) TP18.TP
N$94: OK19.1(A) R51.1
N$95: OK19.2(C) TP19.TP
N$96: OK20.1(A) R52.1
N$97: OK20.2(C) TP20.TP
N$98: OK21.1(A) R53.1
N$99: OK21.2(C) TP21.TP
N$100: OK22.1(A) R54.1
N$101: OK22.2(C) TP22.TP
N$102: OK23.1(A) R55.1
N$103: OK23.2(C) TP23.TP
N$104: OK24.1(A) R56.1
N$105: OK24.2(C) TP24.TP
N$110: OK25.1(A) R57.1
N$111: OK25.2(C) TP26.TP
N$112: OK26.1(A) R58.1
N$113: OK26.2(C) TP27.TP
N$114: OK27.1(A) R59.1
N$115: OK27.2(C) TP28.TP
N$116: OK28.1(A) R60.1
N$117: OK28.2(C) TP29.TP
N$118: OK29.1(A) R61.1
N$119: OK29.2(C) TP30.TP
N$120: OK30.1(A) R62.1
N$121: OK30.2(C) TP31.TP
N$122: OK31.1(A) R63.1
N$123: OK31.2(C) TP32.TP
N$124: OK32.1(A) R64.1
N$125: OK32.2(C) TP33.TP
VCCIO: R49.2 R50.2 R51.2 R52.2 R53.2 R54.2 R55.2 R56.2 R57.2 R58.2 R59.2 R60.2 R61.2 R62.2 R63.2 R64.2 ; also sheet 1,3,4
Unconnected: OK17.6(BAS) OK18.6(BAS) OK19.6(BAS) OK20.6(BAS) OK21.6(BAS) OK22.6(BAS) OK23.6(BAS) OK24.6(BAS) OK25.6(BAS) OK26.6(BAS) OK27.6(BAS) OK28.6(BAS) OK29.6(BAS) OK30.6(BAS) OK31.6(BAS) OK32.6(BAS)

### Notes on the sheet
- HomePi - IO-Platine
  Rev. 2016/08
  
  Eingänge

## Library data of the parts
1WIRE.1-1WIRE.4 +3V3.1-+3V3.4 GND.1-GND.4 GNDIO.1-GNDIO.24 GPIO_06 GPIO_12 GPIO_13 GPIO_16-GPIO_24 IC3_INT IC4_INT J1.1-J1.8 J2.1-J2.8 J3.1-J3.8 J4.1-J4.8 SV2.1-SV2.10 SV3.1-SV3.10 TP1-TP24 TP26-TP33 VCCIO.1-VCCIO.24 = testpad:TP: Test pad
C1-C4 = rcl:C-EU: CAPACITOR, European symbol
IC1-IC4 = micro-philips:PCF8574: I2C-Bus Remote 8-bit I/O expander http://www.semiconductors.philips.com/acrobat_download/datasheets/PCF8574_4.pdf; MPN: PCF8574PN; OC_FARNELL: 204020; OC_NEWARK: 11N8515
J1-J4 = con-amp:555141-1: AMP connector
J5 R65 R66 = jumper:J: Bridge
OK1-OK32 = homepi:CNY17: SIEMENS OPTO COUPLER
R1-R64 R67 R68 = rcl:R-EU_: RESISTOR, European symbol
SJ1-SJ12 = jumper:SJ2W: SMD solder JUMPER
SV1 = homepi:PLATINENVERBINDER-31: 31-poliger Steckverbinder
SV2 SV3 = con-harting-ml:ML10: HARTING; OC_FARNELL: unknown; OC_NEWARK: unknown
T1-T16 = transistor:*-NPN-: NPN Transistror BF959 corrected 2008.03.06

## Board
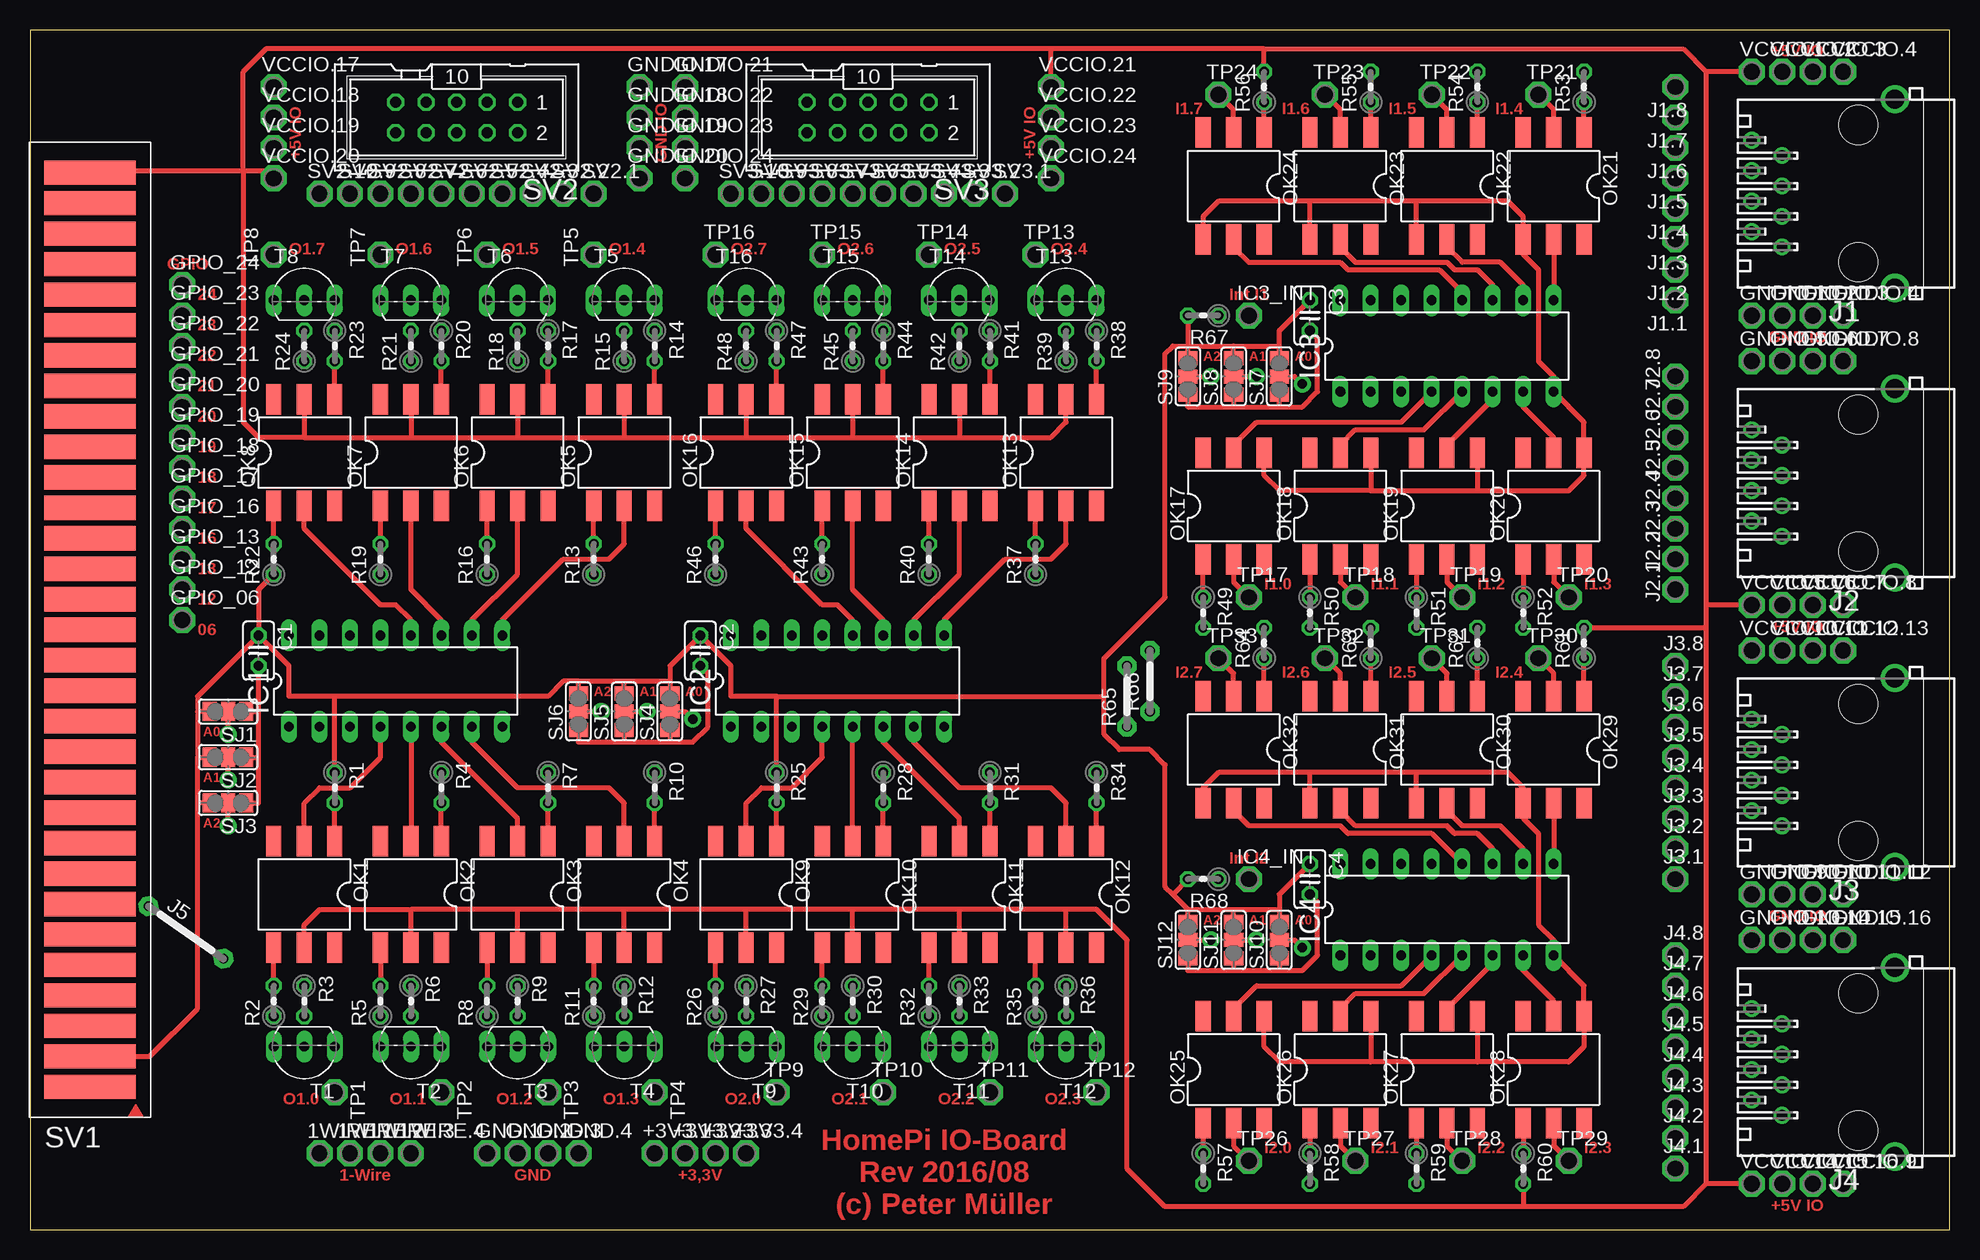
[diagram p5: board, top side]
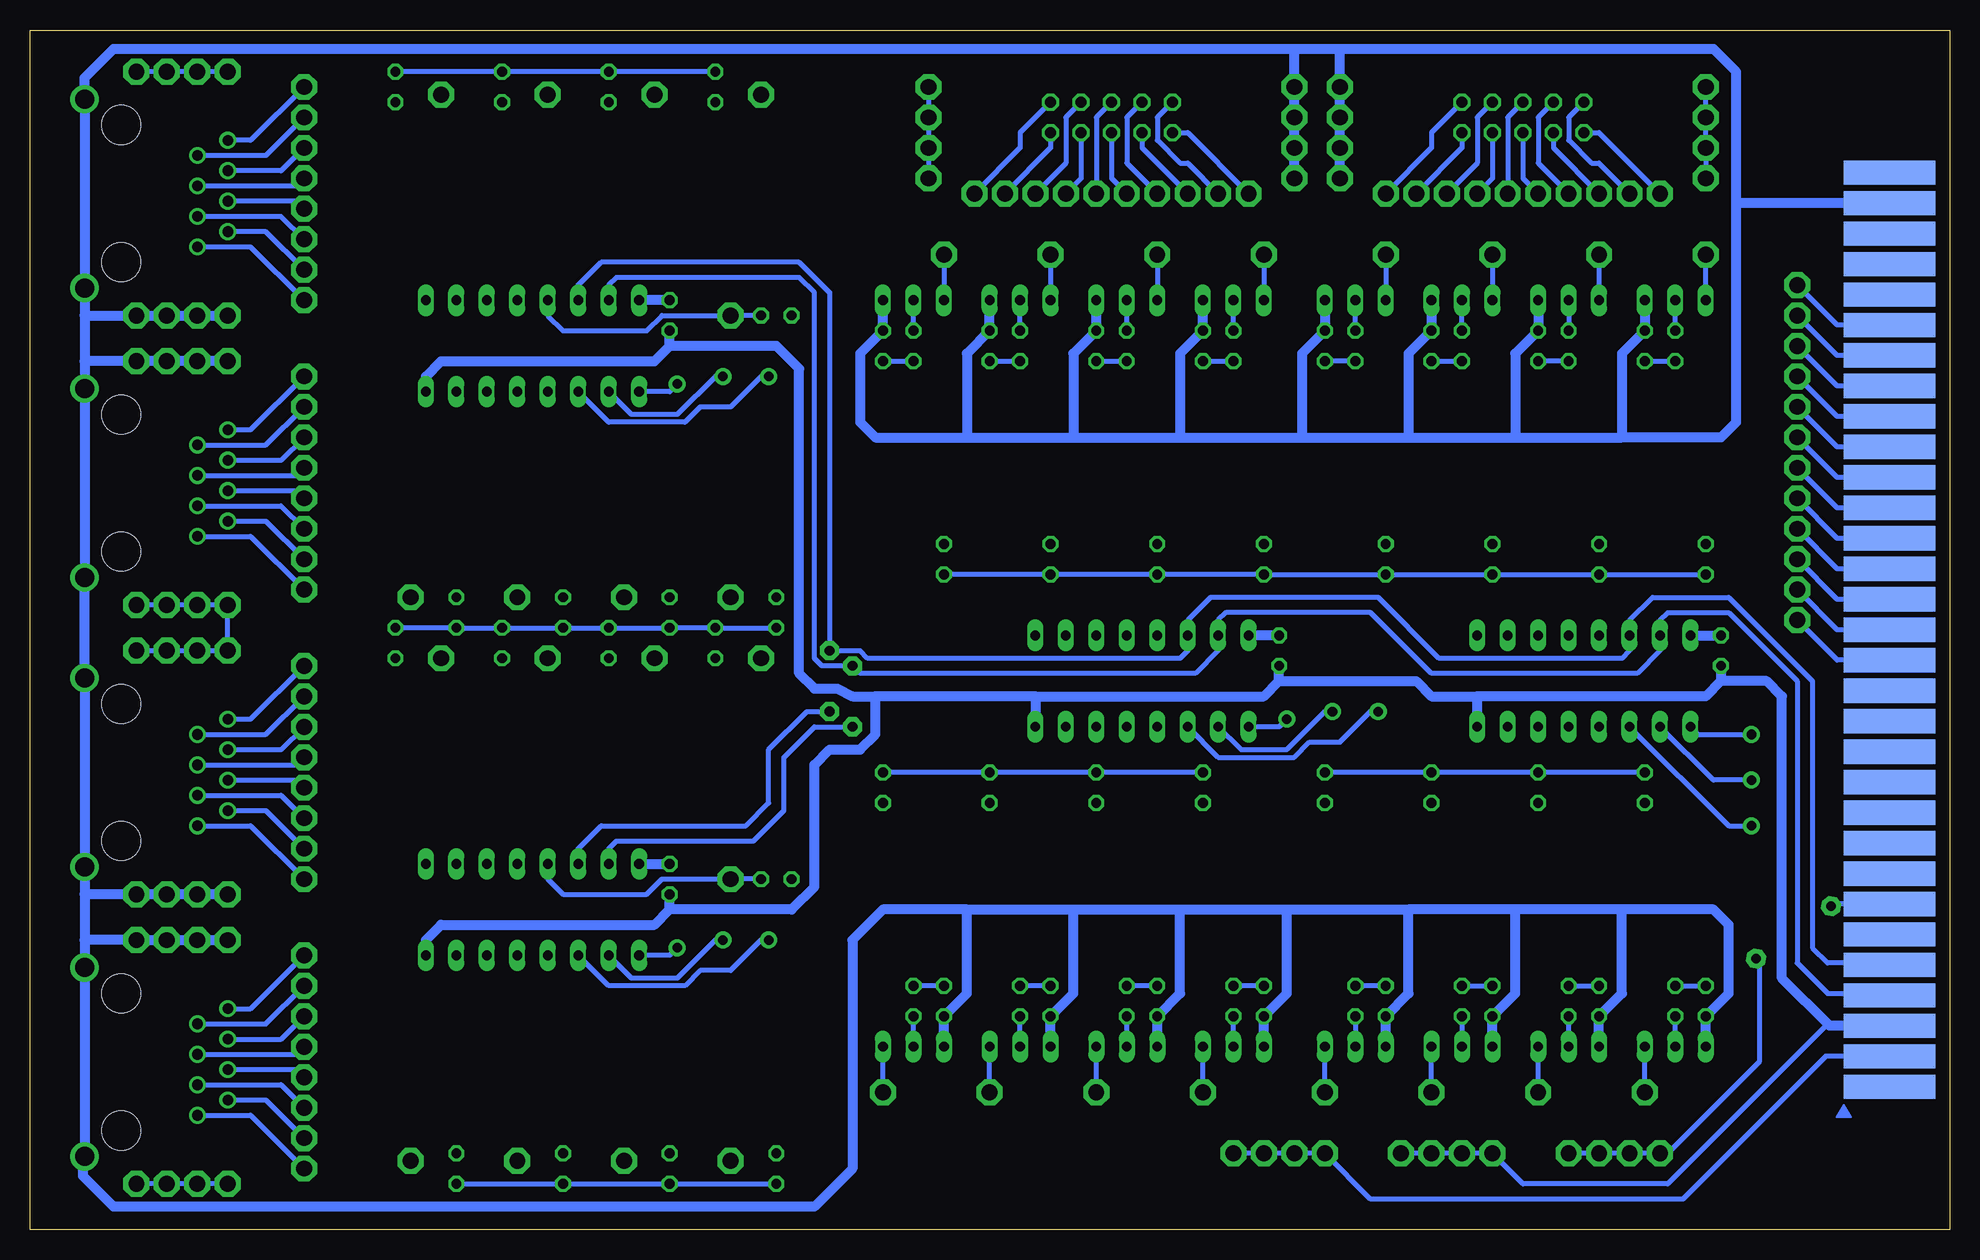
[diagram p6: board, bottom side, seen from below]

Size 160 x 100 mm. Coordinates in mm from the lower left corner, seen from the top.
Outline: 0,0 160,0 160,100 0,100 0,0
Copper layers (1*16): Top 0.035mm / dielectric 1.5mm / Bottom 0.035mm
Design rules "default": minimum track width 10mil, minimum drill 24mil, track to track 8mil, track to pad 8mil, pad to pad 8mil, via to via 8mil, smd to smd 8mil, copper to edge 40mil, drill to drill 8mil, minimum pad ring 10mil, minimum via ring 8mil, stop-mask expansion 4mil, vias tented up to drill 0mil, thermal gap 10mil

### Footprints (pad centres in the part's own frame; a part is rotated, then mirrored left to right if it is on the bottom)
P1-13 = drill 1.321 pad 2.159 octagon: TP 0,0
C025-025X050 = drill 0.813 octagon: 1 -1.27,0; 2 1.27,0
DIL16 = drill 0.813 long: 1 -8.89,-3.81; 2 -6.35,-3.81; 3 -3.81,-3.81; 4 -1.27,-3.81; 5 1.27,-3.81; 6 3.81,-3.81; 7 6.35,-3.81; 8 8.89,-3.81; 9 8.89,3.81; 10 6.35,3.81; 11 3.81,3.81; 12 1.27,3.81; 13 -1.27,3.81; 14 -3.81,3.81; 15 -6.35,3.81; 16 -8.89,3.81
555153-1 = drill 0.889: 1 -4.445,6.35; 2 -3.175,8.89; 3 -1.905,6.35; 4 -0.635,8.89; 5 0.635,6.35; 6 1.905,8.89; 7 3.175,6.35; 8 4.445,8.89 | drill 1.575 pad 2.184: G1 -7.874,-3.048; G2 7.874,-3.048 | hole 3.251: -5.715,0; 5.715,0
07 = drill 0.813 pad 1.6 octagon: 1 -3.81,0; 2 3.81,0
DIL06_SMD = smd 1.27 x 2.54: 1 -2.54,-4.445; 2 0,-4.445; 3 2.54,-4.445; 4 2.54,4.445; 5 0,4.445; 6 -2.54,4.445
0204V = drill 0.813 octagon: 1 -1.27,0; 2 1.27,0
05 = drill 0.813 pad 1.6 octagon: 1 -2.54,0; 2 2.54,0
SJ_2 = smd 1.168 x 1.6: 1 -1.524,0; 2 0,0; 3 1.524,0
PLATINENVERBINDER-31-SMD = smd 7.62 x 2.032 bottom: 1 0,-38.1; 2 0,-35.56; 3 0,-33.02; 4 0,-30.48; 5 0,-27.94; 6 0,-25.4; 7 0,-22.86; 8 0,-20.32; 9 0,-17.78; 10 0,-15.24; 11 0,-12.7; 12 0,-10.16; 13 0,-7.62; 14 0,-5.08; 15 0,-2.54; 16 0,0; 17 0,2.54; 18 0,5.08; 19 0,7.62; 20 0,10.16; 21 0,12.7; 22 0,15.24; 23 0,17.78; 24 0,20.32; 25 0,22.86; 26 0,25.4; 27 0,27.94; 28 0,30.48; 29 0,33.02; 30 0,35.56; 31 0,38.1 | smd 7.62 x 2.032: 1T 0,-38.1; 2T 0,-35.56; 3T 0,-33.02; 4T 0,-30.48; 5T 0,-27.94; 6T 0,-25.4; 7T 0,-22.86; 8T 0,-20.32; 9T 0,-17.78; 10T 0,-15.24; 11T 0,-12.7; 12T 0,-10.16; 13T 0,-7.62; 14T 0,-5.08; 15T 0,-2.54; 16T 0,0; 17T 0,2.54; 18T 0,5.08; 19T 0,7.62; 20T 0,10.16; 21T 0,12.7; 22T 0,15.24; 23T 0,17.78; 24T 0,20.32; 25T 0,22.86; 26T 0,25.4; 27T 0,27.94; 28T 0,30.48; 29T 0,33.02; 30T 0,35.56; 31T 0,38.1
ML10 = drill 0.914 octagon: 1 -5.08,-1.27; 2 -5.08,1.27; 3 -2.54,-1.27; 4 -2.54,1.27; 5 0,-1.27; 6 0,1.27; 7 2.54,-1.27; 8 2.54,1.27; 9 5.08,-1.27; 10 5.08,1.27
TO92-CBE = drill 0.813 long: B 0,0; C -2.54,0; E 2.54,0

### Placement (x,y rotation side)
1WIRE.1  24.13,6.35 0 top
1WIRE.2  26.67,6.35 0 top
1WIRE.3  29.21,6.35 0 top
1WIRE.4  31.75,6.35 0 top
+3V3.1  52.07,6.35 0 top
+3V3.2  54.61,6.35 0 top
+3V3.3  57.15,6.35 0 top
+3V3.4  59.69,6.35 0 top
C1  19.05,48.26 270 top
C2  55.88,48.26 270 top
C3  106.68,76.2 270 top
C4  106.68,29.21 270 top
GND.1  38.1,6.35 0 top
GND.2  40.64,6.35 0 top
GND.3  43.18,6.35 0 top
GND.4  45.72,6.35 0 top
GNDIO.1  143.51,76.2 0 top
GNDIO.2  146.05,76.2 0 top
GNDIO.3  148.59,76.2 0 top
GNDIO.4  151.13,76.2 0 top
GNDIO.5  143.51,72.39 0 top
GNDIO.6  146.05,72.39 0 top
GNDIO.7  148.59,72.39 0 top
GNDIO.8  151.13,72.39 0 top
GNDIO.9  143.51,27.94 0 top
GNDIO.10  146.05,27.94 0 top
GNDIO.11  148.59,27.94 0 top
GNDIO.12  151.13,27.94 0 top
GNDIO.13  143.51,24.13 0 top
GNDIO.14  146.05,24.13 0 top
GNDIO.15  148.59,24.13 0 top
GNDIO.16  151.13,24.13 0 top
GNDIO.17  50.8,95.25 0 top
GNDIO.18  50.8,92.71 0 top
GNDIO.19  50.8,90.17 0 top
GNDIO.20  50.8,87.63 0 top
GNDIO.21  54.61,95.25 0 top
GNDIO.22  54.61,92.71 0 top
GNDIO.23  54.61,90.17 0 top
GNDIO.24  54.61,87.63 0 top
GPIO_06  12.7,50.8 0 top
GPIO_12  12.7,53.34 0 top
GPIO_13  12.7,55.88 0 top
GPIO_16  12.7,58.42 0 top
GPIO_17  12.7,60.96 0 top
GPIO_18  12.7,63.5 0 top
GPIO_19  12.7,66.04 0 top
GPIO_20  12.7,68.58 0 top
GPIO_21  12.7,71.12 0 top
GPIO_22  12.7,73.66 0 top
GPIO_23  12.7,76.2 0 top
GPIO_24  12.7,78.74 0 top
IC1  30.48,45.72 0 top
IC2  67.31,45.72 0 top
IC3  118.11,73.66 0 top
IC3_INT  101.6,76.2 0 top
IC4  118.11,26.67 0 top
IC4_INT  101.6,29.21 0 top
J1  152.4,86.36 90 top
J1.1  137.16,77.47 180 top
J1.2  137.16,80.01 180 top
J1.3  137.16,82.55 180 top
J1.4  137.16,85.09 180 top
J1.5  137.16,87.63 180 top
J1.6  137.16,90.17 180 top
J1.7  137.16,92.71 180 top
J1.8  137.16,95.25 180 top
J2  152.4,62.23 90 top
J2.1  137.16,53.34 90 top
J2.2  137.16,55.88 90 top
J2.3  137.16,58.42 90 top
J2.4  137.16,60.96 90 top
J2.5  137.16,63.5 90 top
J2.6  137.16,66.04 90 top
J2.7  137.16,68.58 90 top
J2.8  137.16,71.12 90 top
J3  152.4,38.1 90 top
J3.1  137.16,29.21 0 top
J3.2  137.16,31.75 0 top
J3.3  137.16,34.29 0 top
J3.4  137.16,36.83 0 top
J3.5  137.16,39.37 0 top
J3.6  137.16,41.91 0 top
J3.7  137.16,44.45 0 top
J3.8  137.16,46.99 0 top
J4  152.4,13.97 90 top
J4.1  137.16,5.08 0 top
J4.2  137.16,7.62 0 top
J4.3  137.16,10.16 0 top
J4.4  137.16,12.7 0 top
J4.5  137.16,15.24 0 top
J4.6  137.16,17.78 0 top
J4.7  137.16,20.32 0 top
J4.8  137.16,22.86 0 top
J5  13,24.77 325 top
OK1  22.86,27.94 180 top
OK2  31.75,27.94 180 top
OK3  40.64,27.94 180 top
OK4  49.53,27.94 180 top
OK5  49.53,64.77 0 top
OK6  40.64,64.77 0 top
OK7  31.75,64.77 0 top
OK8  22.86,64.77 0 top
OK9  59.69,27.94 180 top
OK10  68.58,27.94 180 top
OK11  77.47,27.94 180 top
OK12  86.36,27.94 180 top
OK13  86.36,64.77 0 top
OK14  77.47,64.77 0 top
OK15  68.58,64.77 0 top
OK16  59.69,64.77 0 top
OK17  100.33,60.33 0 top
OK18  109.22,60.33 0 top
OK19  118.11,60.33 0 top
OK20  127,60.33 0 top
OK21  127,87 180 top
OK22  118.11,87 180 top
OK23  109.22,87 180 top
OK24  100.33,87 180 top
OK25  100.33,13.34 0 top
OK26  109.22,13.34 0 top
OK27  118.11,13.34 0 top
OK28  127,13.34 0 top
OK29  127,40.01 180 top
OK30  118.11,40.01 180 top
OK31  109.22,40.01 180 top
OK32  100.33,40.01 180 top
R1  25.4,36.83 270 top
R2  20.32,19.05 90 top
R3  22.86,19.05 270 top
R4  34.29,36.83 270 top
R5  29.21,19.05 90 top
R6  31.75,19.05 270 top
R7  43.18,36.83 270 top
R8  38.1,19.05 90 top
R9  40.64,19.05 270 top
R10  52.07,36.83 270 top
R11  46.99,19.05 90 top
R12  49.53,19.05 270 top
R13  46.99,55.88 90 top
R14  52.07,73.66 270 top
R15  49.53,73.66 90 top
R16  38.1,55.88 90 top
R17  43.18,73.66 270 top
R18  40.64,73.66 90 top
R19  29.21,55.88 90 top
R20  34.29,73.66 270 top
R21  31.75,73.66 90 top
R22  20.32,55.88 90 top
R23  25.4,73.66 270 top
R24  22.86,73.66 90 top
R25  62.23,36.83 270 top
R26  57.15,19.05 90 top
R27  59.69,19.05 270 top
R28  71.12,36.83 270 top
R29  66.04,19.05 90 top
R30  68.58,19.05 270 top
R31  80.01,36.83 270 top
R32  74.93,19.05 90 top
R33  77.47,19.05 270 top
R34  88.9,36.83 270 top
R35  83.82,19.05 90 top
R36  86.36,19.05 270 top
R37  83.82,55.88 90 top
R38  88.9,73.66 270 top
R39  86.36,73.66 90 top
R40  74.93,55.88 90 top
R41  80.01,73.66 270 top
R42  77.47,73.66 90 top
R43  66.04,55.88 90 top
R44  71.12,73.66 270 top
R45  68.58,73.66 90 top
R46  57.15,55.88 90 top
R47  62.23,73.66 270 top
R48  59.69,73.66 90 top
R49  97.79,51.44 270 top
R50  106.68,51.44 270 top
R51  115.57,51.44 270 top
R52  124.46,51.44 270 top
R53  129.54,95.25 90 top
R54  120.65,95.25 90 top
R55  111.76,95.25 90 top
R56  102.87,95.25 90 top
R57  97.79,5.08 270 top
R58  106.68,5.08 270 top
R59  115.57,5.08 270 top
R60  124.46,5.08 270 top
R61  129.54,48.9 90 top
R62  120.65,48.9 90 top
R63  111.76,48.9 90 top
R64  102.87,48.9 90 top
R65  91.44,44.45 90 top
R66  93.34,45.72 90 top
R67  97.79,76.2 180 top
R68  97.79,29.21 180 top
SJ1  16.51,43.18 180 top
SJ2  16.51,39.37 180 top
SJ3  16.51,35.56 180 top
SJ4  53.34,43.18 90 top
SJ5  49.53,43.18 90 top
SJ6  45.72,43.18 90 top
SJ7  104.14,71.12 90 top
SJ8  100.33,71.12 90 top
SJ9  96.52,71.12 90 top
SJ10  104.14,24.13 90 top
SJ11  100.33,24.13 90 top
SJ12  96.52,24.13 90 top
SV1  5,50 0 top
SV2  35.56,92.71 180 top
SV2.1  46.99,86.36 0 top
SV2.2  44.45,86.36 0 top
SV2.3  41.91,86.36 0 top
SV2.4  39.37,86.36 0 top
SV2.5  36.83,86.36 0 top
SV2.6  34.29,86.36 0 top
SV2.7  31.75,86.36 0 top
SV2.8  29.21,86.36 0 top
SV2.9  26.67,86.36 0 top
SV2.10  24.13,86.36 0 top
SV3  69.85,92.71 180 top
SV3.1  81.28,86.36 0 top
SV3.2  78.74,86.36 0 top
SV3.3  76.2,86.36 0 top
SV3.4  73.66,86.36 0 top
SV3.5  71.12,86.36 0 top
SV3.6  68.58,86.36 0 top
SV3.7  66.04,86.36 0 top
SV3.8  63.5,86.36 0 top
SV3.9  60.96,86.36 0 top
SV3.10  58.42,86.36 0 top
T1  22.86,15.24 180 top
T2  31.75,15.24 180 top
T3  40.64,15.24 180 top
T4  49.53,15.24 180 top
T5  49.53,77.47 0 top
T6  40.64,77.47 0 top
T7  31.75,77.47 0 top
T8  22.86,77.47 0 top
T9  59.69,15.24 180 top
T10  68.58,15.24 180 top
T11  77.47,15.24 180 top
T12  86.36,15.24 180 top
T13  86.36,77.47 0 top
T14  77.47,77.47 0 top
T15  68.58,77.47 0 top
T16  59.69,77.47 0 top
TP1  25.4,11.43 270 top
TP2  34.29,11.43 270 top
TP3  43.18,11.43 270 top
TP4  52.07,11.43 270 top
TP5  46.99,81.28 90 top
TP6  38.1,81.28 90 top
TP7  29.21,81.28 90 top
TP8  20.32,81.28 90 top
TP9  62.23,11.43 0 top
TP10  71.12,11.43 0 top
TP11  80.01,11.43 0 top
TP12  88.9,11.43 0 top
TP13  83.82,81.28 0 top
TP14  74.93,81.28 0 top
TP15  66.04,81.28 0 top
TP16  57.15,81.28 0 top
TP17  101.6,52.7 0 top
TP18  110.49,52.7 0 top
TP19  119.38,52.7 0 top
TP20  128.27,52.7 0 top
TP21  125.73,94.61 0 top
TP22  116.84,94.61 0 top
TP23  107.95,94.61 0 top
TP24  99.06,94.61 0 top
TP26  101.6,5.71 0 top
TP27  110.49,5.71 0 top
TP28  119.38,5.71 0 top
TP29  128.27,5.71 0 top
TP30  125.73,47.62 0 top
TP31  116.84,47.62 0 top
TP32  107.95,47.62 0 top
TP33  99.06,47.62 0 top
VCCIO.1  143.51,96.52 0 top
VCCIO.2  146.05,96.52 0 top
VCCIO.3  148.59,96.52 0 top
VCCIO.4  151.13,96.52 0 top
VCCIO.5  143.51,52.07 0 top
VCCIO.6  146.05,52.07 0 top
VCCIO.7  148.59,52.07 0 top
VCCIO.8  151.13,52.07 0 top
VCCIO.9  151.13,3.81 0 top
VCCIO.10  143.51,48.26 0 top
VCCIO.11  146.05,48.26 0 top
VCCIO.12  148.59,48.26 0 top
VCCIO.13  151.13,48.26 0 top
VCCIO.14  143.51,3.81 0 top
VCCIO.15  146.05,3.81 0 top
VCCIO.16  148.59,3.81 0 top
VCCIO.17  20.32,95.25 0 top
VCCIO.18  20.32,92.71 0 top
VCCIO.19  20.32,90.17 0 top
VCCIO.20  20.32,87.63 0 top
VCCIO.21  85.09,95.25 0 top
VCCIO.22  85.09,92.71 0 top
VCCIO.23  85.09,90.17 0 top
VCCIO.24  85.09,87.63 0 top

### Tracks (layer width: path | path; a pad name or v marks a point on that pad's centre or on a via)
1WIRE
  Bottom 0.406: 1WIRE.4.TP 1WIRE.3.TP 1WIRE.2.TP 1WIRE.1.TP 23.5,6.35 15.88,13.97 15.88,22.19 J5.2
+3V3
  Top 0.406: SJ3.3 13.97,35.56 | 13.97,35.56 13.97,39.37 | 13.97,39.37 SJ2.3 | 13.97,43.18 13.97,39.37 | SJ1.3 13.97,43.18 | 13.97,43.18 13.97,44.45 C1.1 | R1.1 25.4,44.45 | 25.4,44.45 21.59,44.45 21.59,46.99 C1.1 | R25.1 62.23,44.45 | 62.23,44.45 58.42,44.45 58.42,46.99 C2.1 53.34,46.99 53.34,45.72 | 45.72,45.72 44.45,45.72 43.18,44.45 25.4,44.45 | SJ6.3 45.72,45.72 | 45.72,45.72 49.53,45.72 | SJ5.3 49.53,45.72 | 49.53,45.72 53.34,45.72 | 53.34,45.72 SJ4.3 | SJ9.3 96.52,73.66 | 96.52,73.66 100.33,73.66 | SJ8.3 100.33,73.66 | 100.33,73.66 104.14,73.66 SJ7.3 104.14,74.93 C3.1 | SJ12.3 96.52,26.67 | 96.52,26.67 100.33,26.67 | SJ11.3 100.33,26.67 | 100.33,26.67 104.14,26.67 | 104.14,26.67 SJ10.3 | C4.1 104.14,27.94 104.14,26.67 | 96.52,73.66 95.25,73.66 94.61,73.03 94.61,52.7 89.53,47.62 89.53,44.45 | 62.23,44.45 89.53,44.45 | 89.53,44.45 89.53,41.27 90.81,40.01 93.34,40.01 94.61,38.73 94.61,28.57 95.25,27.94 | R22.1 19.05,53.34 C1.1 | 13.97,35.56 13.97,18.41 9.99,14.44 SV1.2T | R67.2 96.52,73.66 | 95.25,27.94 96.52,26.67 | R68.2 95.25,27.94
  Bottom 0.406: R22.1 R19.1 R16.1 R13.1 R46.1 R43.1 R40.1 R37.1 | R10.1 R7.1 R4.1 R1.1 | R25.1 R28.1 R31.1 R34.1 | +3V3.4.TP +3V3.3.TP +3V3.2.TP +3V3.1.TP 48.26,2.54 22.23,2.54 10.32,14.44 SV1.2T
  Bottom 0.813: IC1.16 C1.1 | C2.1 IC2.16 | C3.1 IC3.16 | IC4.16 C4.1
GND
  Top 0.406: SJ3.1 19.05,35.56 19.05,39.37 | 19.05,39.37 19.05,43.18 | SJ1.1 19.05,43.18 | SJ2.1 19.05,39.37 | 19.05,43.18 C1.2 | SJ6.1 45.72,40.64 49.53,40.64 | SJ5.1 49.53,40.64 | 49.53,40.64 53.34,40.64 | SJ4.1 53.34,40.64 | C2.2 56.52,46.35 56.52,41.91 55.24,40.64 53.34,40.64 | SJ9.1 96.52,68.58 100.33,68.58 | SJ8.1 100.33,68.58 | 100.33,68.58 104.14,68.58 | 104.14,68.58 SJ7.1 | 104.14,68.58 106.05,68.58 107.31,69.85 107.31,74.3 C3.2 | 111.76,61.59 120.65,61.59 | 120.65,61.59 128.27,61.59 129.54,62.87 OK20.4 129.54,67.31 IC3.8 127,71.12 125.73,72.39 125.73,80.01 124.46,81.28 OK21.4 124.46,84.45 123.19,85.72 115.57,85.72 | OK19.4 120.65,61.59 | OK18.4 111.76,61.59 | 115.57,85.72 106.68,85.72 | OK23.4 106.68,85.72 | OK22.4 115.57,85.72 | 115.57,38.1 123.19,38.1 124.46,36.83 OK29.4 124.46,34.29 125.73,33.02 125.73,25.4 127,24.13 IC4.8 129.54,20.32 OK28.4 129.54,15.24 128.27,13.97 120.65,13.97 | 115.57,38.1 106.68,38.1 | OK31.4 106.68,38.1 | OK30.4 115.57,38.1 | 120.65,13.97 111.76,13.97 | 111.76,13.97 104.14,13.97 102.87,15.24 OK25.4 | OK26.4 111.76,13.97 | OK27.4 120.65,13.97 | 111.76,61.59 104.14,61.59 102.87,62.87 OK17.4 | SJ12.1 96.52,21.59 100.33,21.59 | SJ11.1 100.33,21.59 | 100.33,21.59 104.14,21.59 | SJ10.1 104.14,21.59 | 104.14,21.59 106.05,21.59 107.31,22.86 107.31,27.3 C4.2 | 106.68,38.1 99.06,38.1 97.79,36.83 OK32.4 | 106.68,85.72 99.06,85.72 97.79,84.45 OK24.4
  Bottom 0.406: SV1.3T 10.32,16.98 23.5,3.81 35.56,3.81 GND.1.TP GND.2.TP GND.3.TP GND.4.TP
  Bottom 0.813: C1.2 19.05,45.72 | 76.2,44.45 IC2.8 | IC1.8 39.37,44.45 | 106.68,73.66 107.95,72.39 125.73,72.39 127,71.12 IC3.8 | 106.68,73.66 C3.2 | 76.2,44.45 57.15,44.45 55.88,45.72 | 55.88,45.72 44.45,45.72 43.18,44.45 39.37,44.45 | 55.88,45.72 C2.2 | IC4.8 127,24.13 125.73,25.4 107.95,25.4 106.68,26.67 | 106.68,26.67 C4.2 | 106.68,73.66 97.79,73.66 95.89,71.75 95.89,46.35 94.61,45.09 92.71,45.09 91.44,44.45 89.53,44.45 | 76.2,44.45 89.53,44.45 | 89.53,44.45 89.53,41.27 90.81,40.01 93.34,40.01 94.61,38.73 94.61,28.57 96.52,26.67 106.68,26.67 | 19.05,45.72 15.24,45.72 13.97,44.45 13.97,20.95 9.99,16.98 SV1.3T | 19.05,45.72 20.32,44.45 39.37,44.45
GNDIO
  Bottom 0.813: T8.E R23.1 27.3,73.03 27.3,66.04 | T7.E R20.1 36.2,73.03 36.2,66.04 | T1.E R2.1 18.41,19.68 18.41,25.4 19.68,26.67 27.3,26.67 | 27.3,26.67 36.2,26.67 | 36.2,26.67 45.09,26.67 | 45.09,66.04 36.2,66.04 | 36.2,66.04 27.3,66.04 | 27.3,26.67 27.3,19.68 R5.1 T2.E | 36.2,26.67 36.2,19.68 R8.1 T3.E | 45.09,26.67 45.09,19.68 R11.1 T4.E | 45.09,66.04 45.09,73.03 R17.1 T6.E | T5.E R14.1 53.98,73.03 53.98,66.04 | SV1.30T 17.78,85.56 | 27.3,66.04 19.05,66.04 17.78,67.31 17.78,85.56 | 155.45,76.2 J1.G1 J1.G2 155.45,96.01 153.03,98.42 54.61,98.42 | 155.45,76.2 155.45,72.39 | 155.45,72.39 J2.G2 J2.G1 J3.G2 J3.G1 155.45,27.94 | 81.92,66.04 89.53,66.04 90.81,67.31 90.81,73.03 R38.1 T13.E | 81.92,66.04 73.03,66.04 | 73.03,66.04 64.14,66.04 | 64.14,66.04 53.98,66.04 | 53.98,66.04 45.09,66.04 | 81.92,66.04 81.92,73.03 R41.1 T14.E | 73.03,66.04 73.03,73.03 R44.1 T15.E | 64.14,66.04 64.14,73.03 R47.1 T16.E | 55.24,26.67 55.24,19.68 R26.1 T9.E | 55.24,26.67 45.09,26.67 | 81.92,26.67 81.92,19.68 R35.1 T12.E | 81.92,26.67 73.03,26.67 | 73.03,26.67 64.14,26.67 | 64.14,26.67 55.24,26.67 | 73.03,26.67 73.03,19.68 R32.1 T11.E | 64.14,26.67 64.14,19.68 R29.1 T10.E | 54.61,98.42 50.8,98.42 | 50.8,98.42 19.68,98.42 17.78,96.52 17.78,85.56 | 155.45,27.94 155.45,24.13 | 155.45,24.13 J4.G2 J4.G1 155.57,5.97 155.57,4.45 153.03,1.91 94.61,1.91 91.44,5.08 91.44,24.13 88.9,26.67 81.92,26.67 | 155.45,76.2 GNDIO.4.TP GNDIO.3.TP GNDIO.2.TP GNDIO.1.TP | GNDIO.5.TP GNDIO.6.TP GNDIO.7.TP GNDIO.8.TP 155.45,72.39 | 155.45,27.94 GNDIO.12.TP GNDIO.11.TP GNDIO.10.TP GNDIO.9.TP | 155.45,24.13 GNDIO.16.TP GNDIO.15.TP GNDIO.14.TP GNDIO.13.TP | GNDIO.20.TP GNDIO.19.TP GNDIO.18.TP GNDIO.17.TP 50.8,98.42
  Bottom 0.813: GNDIO.24.TP GNDIO.23.TP GNDIO.22.TP GNDIO.21.TP 54.61,98.42
IN_1.0
  Top 0.406: OK17.5 100.33,65.41 102.23,67.31 114.3,67.31 IC3.4
IN_1.1
  Top 0.406: OK18.5 109.22,65.41 110.49,66.67 116.2,66.67 IC3.5
IN_1.2
  Top 0.406: OK19.5 118.11,65.41 121.92,69.22 IC3.6
IN_1.3
  Top 0.406: OK20.5 127,66.04 124.46,68.58 IC3.7
IN_1.4
  Top 0.406: OK21.5 IC3.9
IN_1.5
  Top 0.406: IC3.10 124.46,78.74 122.56,80.64 119.38,80.64 118.11,81.92 OK22.5
IN_1.6
  Top 0.406: OK23.5 109.22,81.92 110.49,80.64 118.11,80.64 118.75,80.01 120.65,80.01 121.92,78.74 IC3.11
IN_1.7
  Top 0.406: OK24.5 100.33,81.92 101.6,80.64 109.22,80.64 109.86,80.01 117.47,80.01 119.38,78.11 IC3.12
IN_2.0
  Top 0.406: OK25.5 100.33,18.41 102.23,20.32 114.3,20.32 IC4.4
IN_2.1
  Top 0.406: OK26.5 109.22,18.41 110.49,19.68 116.2,19.68 IC4.5
IN_2.2
  Top 0.406: OK27.5 118.11,18.41 121.92,22.23 IC4.6
IN_2.3
  Top 0.406: OK28.5 127,19.05 124.46,21.59 IC4.7
IN_2.4
  Top 0.406: OK29.5 IC4.9
IN_2.5
  Top 0.406: IC4.10 124.46,31.75 122.56,33.66 119.38,33.66 118.11,34.92 OK30.5
IN_2.6
  Top 0.406: IC4.11 121.92,31.75 120.65,33.02 118.75,33.02 118.11,33.66 110.49,33.66 109.22,34.92 OK31.5
IN_2.7
  Top 0.406: IC4.12 116.84,33.02 109.86,33.02 109.22,33.66 101.6,33.66 100.33,34.92 OK32.5
N$1  (via drill 0.8 pad 1.42)
  Top 0.406: v16.51,41.27 SJ1.2
  Bottom 0.406: IC1.1 20.95,41.27 v16.51,41.27
N$2  (via drill 0.8 pad 1.42)
  Top 0.406: v16.51,37.47 SJ2.2
  Bottom 0.406: v16.51,37.47 19.68,37.47 IC1.2
N$3  (via drill 0.8 pad 1.42)
  Top 0.406: v16.51,33.66 SJ3.2
  Bottom 0.406: IC1.3 18.41,33.66 v16.51,33.66
N$4
  Bottom 0.406: TP1.TP T1.C
N$5
  Top 0.406: OK1.1 R1.2
N$6
  Top 0.406: R2.2 OK1.4
  Bottom 0.406: R3.1 R2.2
N$7
  Bottom 0.406: T1.B R3.2
N$8
  Bottom 0.406: TP2.TP T2.C
N$9
  Top 0.406: OK2.1 R4.2
N$10
  Top 0.406: OK2.4 R5.2
  Bottom 0.406: R6.1 R5.2
N$11
  Bottom 0.406: T2.B R6.2
N$12
  Bottom 0.406: TP3.TP T3.C
N$13
  Top 0.406: OK3.1 R7.2
N$14
  Top 0.406: OK3.4 R8.2
  Bottom 0.406: R9.1 R8.2
N$15
  Bottom 0.406: R9.2 T3.B
N$16
  Bottom 0.406: TP4.TP T4.C
N$17
  Top 0.406: OK4.1 R10.2
N$18
  Top 0.406: OK4.4 R11.2
  Bottom 0.406: R11.2 R12.1
N$19
  Bottom 0.406: R12.2 T4.B
N$20
  Bottom 0.406: TP5.TP T5.C
N$21
  Top 0.406: R13.2 OK5.1
N$22
  Top 0.406: OK5.4 R14.2
  Bottom 0.406: R15.1 R14.2
N$23
  Bottom 0.406: R15.2 T5.B
N$24
  Bottom 0.406: TP6.TP T6.C
N$25
  Top 0.406: R16.2 OK6.1
N$26
  Top 0.406: OK6.4 R17.2
  Bottom 0.406: R17.2 R18.1
N$27
  Bottom 0.406: R18.2 T6.B
N$28
  Bottom 0.406: TP7.TP T7.C
N$29
  Top 0.406: R19.2 OK7.1
N$30
  Top 0.406: OK7.4 R20.2
  Bottom 0.406: R21.1 R20.2
N$31
  Bottom 0.406: T7.B R21.2
N$32
  Bottom 0.406: T8.C TP8.TP
N$33
  Top 0.406: R22.2 OK8.1
N$34
  Top 0.406: OK8.4 R23.2
  Bottom 0.406: R23.2 R24.1
N$35
  Bottom 0.406: R24.2 T8.B
N$36
  Bottom 0.406: J1.1.TP 141.6,81.92 J1.1
N$37
  Bottom 0.406: J1.2.TP 140.34,83.19 J1.2
N$38
  Bottom 0.406: J1.3 139.06,84.45 J1.3.TP
N$39
  Bottom 0.406: J1.4 137.79,85.72 J1.4.TP
N$40
  Bottom 0.406: J1.5 137.79,87 J1.5.TP
N$41
  Bottom 0.406: J1.6 139.06,88.27 J1.6.TP
N$42
  Bottom 0.406: J1.7.TP 140.34,89.53 J1.7
N$43
  Bottom 0.406: J1.8.TP 141.6,90.81 J1.8
N$44
  Bottom 0.406: J2.1 141.6,57.78 J2.1.TP
N$45
  Bottom 0.406: J2.2 140.34,59.05 J2.2.TP
N$46
  Bottom 0.406: J2.3 139.06,60.33 J2.3.TP
N$47
  Bottom 0.406: J2.4 137.79,61.59 J2.4.TP
N$48
  Bottom 0.406: J2.5 137.79,62.87 J2.5.TP
N$49
  Bottom 0.406: J2.6 139.06,64.14 J2.6.TP
N$50
  Bottom 0.406: J2.7 140.34,65.41 J2.7.TP
N$51
  Bottom 0.406: J2.8 141.6,66.67 J2.8.TP
N$52
  Bottom 0.406: TP9.TP T9.C
N$53
  Top 0.406: OK9.1 R25.2
N$54
  Top 0.406: R26.2 OK9.4
  Bottom 0.406: R26.2 R27.1
N$55
  Bottom 0.406: T9.B R27.2
N$56
  Bottom 0.406: TP10.TP T10.C
N$57
  Top 0.406: OK10.1 R28.2
N$58
  Top 0.406: R29.2 OK10.4
  Bottom 0.406: R29.2 R30.1
N$59
  Bottom 0.406: T10.B R30.2
N$60
  Bottom 0.406: TP11.TP T11.C
N$61
  Top 0.406: OK11.1 R31.2
N$62
  Top 0.406: R32.2 OK11.4
  Bottom 0.406: R32.2 R33.1
N$63
  Bottom 0.406: T11.B R33.2
N$64
  Bottom 0.406: TP12.TP T12.C
N$65
  Top 0.406: OK12.1 R34.2
N$66
  Top 0.406: R35.2 OK12.4
  Bottom 0.406: R35.2 R36.1
N$67
  Bottom 0.406: T12.B R36.2
N$68
  Bottom 0.406: TP13.TP T13.C
N$69
  Top 0.406: R37.2 OK13.1
N$70
  Top 0.406: OK13.4 R38.2
  Bottom 0.406: R38.2 R39.1
N$71
  Bottom 0.406: R39.2 T13.B
N$72
  Bottom 0.406: TP14.TP T14.C
N$73
  Top 0.406: R40.2 OK14.1
N$74
  Top 0.406: OK14.4 R41.2
  Bottom 0.406: R41.2 R42.1
N$75
  Bottom 0.406: R42.2 T14.B
N$76
  Bottom 0.406: TP15.TP T15.C
N$77
  Top 0.406: R43.2 OK15.1
N$78
  Top 0.406: OK15.4 R44.2
  Bottom 0.406: R44.2 R45.1
N$79
  Bottom 0.406: R45.2 T15.B
N$80
  Bottom 0.406: TP16.TP T16.C
N$81
  Top 0.406: R46.2 OK16.1
N$82
  Top 0.406: OK16.4 R47.2
  Bottom 0.406: R47.2 R48.1
N$83
  Bottom 0.406: R48.2 T16.B
N$84  (via drill 0.8 pad 1.42)
  Top 0.406: SJ4.2 54.61,43.18 v55.24,42.55
  Bottom 0.406: v55.24,42.55 55.88,41.91 IC2.1
N$85  (via drill 0.8 pad 1.42)
  Top 0.406: SJ5.2 v51.44,43.18
  Bottom 0.406: v51.44,43.18 52.07,43.18 55.24,40.01 59.05,40.01 IC2.2
N$86  (via drill 0.8 pad 1.42)
  Top 0.406: SJ6.2 v47.62,43.18
  Bottom 0.406: v47.62,43.18 48.26,43.18 50.8,40.64 53.34,40.64 54.61,39.37 60.96,39.37 IC2.3
N$87  (via drill 0.8 pad 1.42)
  Top 0.406: SJ7.2 105.41,71.12 v106.05,70.48
  Bottom 0.406: v106.05,70.48 106.68,69.85 IC3.1
N$88  (via drill 0.8 pad 1.42)
  Top 0.406: SJ8.2 v102.23,71.12
  Bottom 0.406: v102.23,71.12 102.87,71.12 106.05,67.94 109.86,67.94 IC3.2
N$89  (via drill 0.8 pad 1.42)
  Top 0.406: SJ9.2 v98.42,71.12
  Bottom 0.406: v98.42,71.12 99.06,71.12 101.6,68.58 104.14,68.58 105.41,67.31 111.76,67.31 IC3.3
N$90
  Top 0.406: R49.1 OK17.1
N$91
  Top 0.406: OK17.2 100.33,53.98 TP17.TP
N$92
  Top 0.406: OK18.1 R50.1
N$93
  Top 0.406: OK18.2 109.22,53.98 TP18.TP
N$94
  Top 0.406: OK19.1 R51.1
N$95
  Top 0.406: OK19.2 118.11,53.98 TP19.TP
N$96
  Top 0.406: OK20.1 R52.1
N$97
  Top 0.406: OK20.2 127,53.98 TP20.TP
N$98
  Top 0.406: OK21.1 R53.1
N$99
  Top 0.406: OK21.2 127,93.34 TP21.TP
N$100
  Top 0.406: OK22.1 R54.1
N$101
  Top 0.406: OK22.2 118.11,93.34 TP22.TP
N$102
  Top 0.406: OK23.1 R55.1
N$103
  Top 0.406: OK23.2 109.22,93.34 TP23.TP
N$104
  Top 0.406: OK24.1 R56.1
N$105
  Top 0.406: OK24.2 100.33,93.34 TP24.TP
N$106
  Bottom 0.406: IC3.13 116.84,76.2 115.57,74.93 108.58,74.93 107.31,76.2 IC3_INT.TP R67.1
N$107  (via drill 0.8 pad 1.42)
  Top 0.406: SJ10.2 105.41,24.13 v106.05,23.5
  Bottom 0.406: v106.05,23.5 106.68,22.86 IC4.1
N$108  (via drill 0.8 pad 1.42)
  Top 0.406: SJ11.2 v102.23,24.13
  Bottom 0.406: v102.23,24.13 102.87,24.13 106.05,20.95 109.86,20.95 IC4.2
N$109  (via drill 0.8 pad 1.42)
  Top 0.406: SJ12.2 v98.42,24.13
  Bottom 0.406: v98.42,24.13 99.06,24.13 101.6,21.59 104.14,21.59 105.41,20.32 111.76,20.32 IC4.3
N$110
  Top 0.406: OK25.1 R57.1
N$111
  Top 0.406: OK25.2 100.33,6.99 TP26.TP
N$112
  Top 0.406: OK26.1 R58.1
N$113
  Top 0.406: OK26.2 109.22,6.99 TP27.TP
N$114
  Top 0.406: OK27.1 R59.1
N$115
  Top 0.406: OK27.2 118.11,6.99 TP28.TP
N$116
  Top 0.406: OK28.1 R60.1
N$117
  Top 0.406: OK28.2 127,6.99 TP29.TP
N$118
  Top 0.406: OK29.1 R61.1
N$119
  Top 0.406: OK29.2 127,46.35 TP30.TP
N$120
  Top 0.406: OK30.1 R62.1
N$121
  Top 0.406: OK30.2 118.11,46.35 TP31.TP
N$122
  Top 0.406: OK31.1 R63.1
N$123
  Top 0.406: OK31.2 109.22,46.35 TP32.TP
N$124
  Top 0.406: OK32.1 R64.1
N$125
  Top 0.406: OK32.2 100.33,46.35 TP33.TP
N$126
  Bottom 0.406: IC4.13 116.84,29.21 115.57,27.94 108.58,27.94 107.31,29.21 IC4_INT.TP R68.1
N$127
  Bottom 0.406: IC4.15 111.76,31.75 111.12,32.38 99.69,32.38 97.16,34.92 97.16,39.37 94.61,41.91 R65.1
N$128
  Bottom 0.406: IC4.14 114.3,31.75 112.39,33.66 100.33,33.66 98.42,35.56 98.42,40.01 95.25,43.18 R66.1
N$129
  Bottom 0.406: J3.1 141.6,33.66 J3.1.TP
N$130
  Bottom 0.406: J3.2 140.34,34.92 J3.2.TP
N$131
  Bottom 0.406: J3.3 139.06,36.2 J3.3.TP
N$132
  Bottom 0.406: J3.4 137.79,37.47 J3.4.TP
N$133
  Bottom 0.406: J3.5 137.79,38.73 J3.5.TP
N$134
  Bottom 0.406: J3.6 139.06,40.01 J3.6.TP
N$135
  Bottom 0.406: J3.7 140.34,41.27 J3.7.TP
N$136
  Bottom 0.406: J3.8 141.6,42.55 J3.8.TP
N$137
  Bottom 0.406: J4.1 141.6,9.53 J4.1.TP
N$138
  Bottom 0.406: J4.2 140.34,10.79 J4.2.TP
N$139
  Bottom 0.406: J4.3 139.06,12.06 J4.3.TP
N$140
  Bottom 0.406: J4.4 137.79,13.34 J4.4.TP
N$141
  Bottom 0.406: J4.5 137.79,14.61 J4.5.TP
N$142
  Bottom 0.406: J4.6 139.06,15.88 J4.6.TP
N$143
  Bottom 0.406: J4.7 140.34,17.14 J4.7.TP
N$144
  Bottom 0.406: J4.8 141.6,18.41 J4.8.TP
N$145
  Bottom 0.406: SV1.7 9.69,27.14 J5.1
N$146
  Bottom 0.406: SV1.25T 9.36,72.86 GPIO_23.TP
N$147
  Bottom 0.406: SV1.24 9.36,70.32 GPIO_22.TP
N$148
  Bottom 0.406: SV1.23T 9.36,67.78 GPIO_21.TP
N$149
  Bottom 0.406: SV1.22 9.36,65.24 GPIO_20.TP
N$150
  Bottom 0.406: SV1.21 9.36,62.7 GPIO_19.TP
N$151
  Bottom 0.406: SV1.20T 9.36,60.16 GPIO_18.TP
N$152
  Bottom 0.406: SV1.19 9.36,57.62 GPIO_17.TP
N$153
  Bottom 0.406: SV1.18 9.36,55.08 GPIO_16.TP
N$154
  Bottom 0.406: SV1.17 9.36,52.54 GPIO_13.TP
N$155
  Bottom 0.406: SV1.16 9.36,50 GPIO_12.TP
N$156
  Bottom 0.406: SV1.15 9.36,47.46 GPIO_06.TP
N$157
  Bottom 0.406: SV2.1 43.18,91.44 43.18,90.17 SV2.1.TP
N$158
  Bottom 0.406: SV2.2 40.64,90.17 SV2.2.TP
N$159
  Bottom 0.406: SV2.3 39.37,92.71 39.37,88.9 SV2.3.TP
N$160
  Bottom 0.406: SV2.4 38.1,87.63 SV2.4.TP
N$161
  Bottom 0.406: SV2.5 36.83,92.71 SV2.5.TP
N$162
  Bottom 0.406: SV2.6 35.56,87.63 SV2.6.TP
N$163
  Bottom 0.406: SV2.7 34.29,92.71 34.29,88.9 SV2.7.TP
N$164
  Bottom 0.406: SV2.8 33.02,90.17 SV2.8.TP
N$165
  Bottom 0.406: SV2.9 31.75,92.71 31.75,90.81 29.84,88.9 29.21,88.9 SV2.9.TP
N$166
  Bottom 0.406: SV2.10 29.21,91.44 SV2.10.TP
N$167
  Bottom 0.406: SV3.1 77.47,91.44 77.47,90.17 SV3.1.TP
N$168
  Bottom 0.406: SV3.2 74.93,90.17 SV3.2.TP
N$169
  Bottom 0.406: SV3.3 73.66,92.71 73.66,88.9 SV3.3.TP
N$170
  Bottom 0.406: SV3.4 72.39,87.63 SV3.4.TP
N$171
  Bottom 0.406: SV3.5 71.12,92.71 SV3.5.TP
N$172
  Bottom 0.406: SV3.6 69.85,87.63 SV3.6.TP
N$173
  Bottom 0.406: SV3.7 68.58,92.71 68.58,88.9 SV3.7.TP
N$174
  Bottom 0.406: SV3.8 67.31,90.17 SV3.8.TP
N$175
  Bottom 0.406: SV3.9 66.04,92.71 66.04,90.81 64.14,88.9 63.5,88.9 SV3.9.TP
N$176
  Bottom 0.406: SV3.10 63.5,91.44 SV3.10.TP
N$177
  Bottom 0.406: SV1.26 9.36,75.4 GPIO_24.TP
OUT_1.0
  Top 0.406: OK1.2 22.86,35.56 24.13,36.83 26.67,36.83 29.21,39.37 IC1.4
OUT_1.1
  Top 0.406: IC1.5 OK2.2
OUT_1.2
  Top 0.406: OK3.2 40.64,34.29 34.29,40.64 IC1.6
OUT_1.3
  Top 0.406: OK4.2 49.53,35.56 48.26,36.83 40.64,36.83 36.83,40.64 IC1.7
OUT_1.4
  Top 0.406: IC1.9 39.37,50.8 44.45,55.88 48.26,55.88 49.53,57.15 OK5.2
OUT_1.5
  Top 0.406: IC1.10 36.83,50.8 40.64,54.61 OK6.2
OUT_1.6
  Top 0.406: IC1.11 34.29,50.8 31.75,53.34 OK7.2
OUT_1.7
  Top 0.406: IC1.12 31.75,50.8 30.48,52.07 29.21,52.07 22.86,58.42 OK8.2
OUT_2.0
  Top 0.406: OK9.2 59.69,35.56 60.96,36.83 63.5,36.83 66.04,39.37 IC2.4
OUT_2.1
  Top 0.406: OK10.2 IC2.5
OUT_2.2
  Top 0.406: OK11.2 77.47,34.29 71.12,40.64 IC2.6
OUT_2.3
  Top 0.406: OK12.2 86.36,35.56 85.09,36.83 77.47,36.83 73.66,40.64 IC2.7
OUT_2.4
  Top 0.406: IC2.9 76.2,50.8 81.28,55.88 85.09,55.88 86.36,57.15 OK13.2
OUT_2.5
  Top 0.406: IC2.10 73.66,50.8 77.47,54.61 OK14.2
OUT_2.6
  Top 0.406: IC2.11 71.12,50.8 68.58,53.34 OK15.2
OUT_2.7
  Top 0.406: IC2.12 68.58,50.8 67.31,52.07 66.04,52.07 59.69,58.42 OK16.2
SCL
  Bottom 0.406: SV1.5T 5.17,22.23 10.16,22.23 11.43,23.5 11.43,45.72 18.41,52.7 24.77,52.7 26.67,50.8 IC1.14 26.67,48.26 27.3,47.62 42.55,47.62 47.62,52.7 61.59,52.7 63.5,50.8 IC2.14 63.5,48.26 64.14,47.62 90.17,47.62 90.81,48.26 R66.2 93.34,78.11 95.89,80.64 112.39,80.64 114.3,78.74 IC3.14
SDA
  Bottom 0.406: IC3.15 111.76,78.74 111.12,79.38 95.89,79.38 94.61,78.11 94.61,47.62 93.98,46.99 R65.2 90.81,46.35 62.87,46.35 60.96,48.26 IC2.15 60.96,50.8 60.33,51.44 48.26,51.44 43.18,46.35 26.04,46.35 24.13,48.26 IC1.15 24.13,50.8 23.5,51.44 18.41,51.44 12.7,45.72 12.7,22.23 10.16,19.68 5.17,19.68 SV1.4T
VCCIO
  Top 0.406: SV1.31T 5.17,88.27 17.78,88.27 | 22.86,66.04 31.75,66.04 | 31.75,66.04 40.64,66.04 | 40.64,26.67 31.75,26.67 | OK2.5 31.75,26.67 | OK3.5 40.64,26.67 | OK6.5 40.64,66.04 | OK7.5 31.75,66.04 | OK8.5 22.86,66.04 | 22.86,66.04 19.05,66.04 17.78,67.31 17.78,88.27 | 40.64,66.04 49.53,66.04 | 49.53,66.04 59.69,66.04 | 59.69,66.04 68.58,66.04 | 68.58,66.04 77.47,66.04 | 77.47,66.04 85.09,66.04 86.36,67.31 OK13.5 | OK14.5 77.47,66.04 | OK15.5 68.58,66.04 | OK16.5 59.69,66.04 | OK5.5 49.53,66.04 | 86.36,26.67 77.47,26.67 | 77.47,26.67 68.58,26.67 | 68.58,26.67 59.69,26.67 | 59.69,26.67 49.53,26.67 | 49.53,26.67 40.64,26.67 | OK11.5 77.47,26.67 | OK10.5 68.58,26.67 | OK9.5 59.69,26.67 | OK4.5 49.53,26.67 | OK12.5 86.36,26.67 | OK1.5 22.86,25.4 24.13,26.67 31.75,26.67 | R56.2 102.87,98.42 | 102.87,98.42 85.09,98.42 | 85.09,98.42 19.68,98.42 17.78,96.52 17.78,88.27 | 102.87,98.42 137.79,98.42 139.7,96.52 | 139.7,96.52 139.7,52.07 | 139.7,52.07 139.7,50.16 | 139.7,50.16 139.7,3.81 | 139.7,3.81 137.79,1.91 124.46,1.91 | 124.46,1.91 94.61,1.91 91.44,5.08 91.44,24.13 88.9,26.67 86.36,26.67 | R60.2 124.46,1.91 | 139.7,50.16 R61.2 | VCCIO.1.TP 139.7,96.52 | VCCIO.5.TP 139.7,52.07 | VCCIO.14.TP 139.7,3.81 | VCCIO.21.TP 85.09,98.42 | 17.78,88.27 19.68,88.27 VCCIO.20.TP
  Bottom 0.406: R49.2 R64.2 R50.2 R63.2 R51.2 R62.2 R52.2 R61.2 | R56.2 R55.2 R54.2 R53.2 | R60.2 R59.2 R58.2 R57.2 | VCCIO.20.TP VCCIO.19.TP VCCIO.18.TP VCCIO.17.TP | VCCIO.21.TP VCCIO.22.TP VCCIO.23.TP VCCIO.24.TP | VCCIO.1.TP VCCIO.2.TP VCCIO.3.TP VCCIO.4.TP | VCCIO.14.TP VCCIO.15.TP VCCIO.16.TP VCCIO.9.TP | VCCIO.8.TP VCCIO.7.TP VCCIO.6.TP VCCIO.5.TP VCCIO.10.TP VCCIO.11.TP VCCIO.12.TP VCCIO.13.TP

### Text on the board
Top: +5V IO | I1.7 | I1.6 | I1.5 | I1.4 | +5V IO | GND IO | +5V IO | O1.7 | O1.6 | O1.5 | O1.4 | O2.7 | O2.6 | O2.5 | O2.4 | GPIO | 24 | Int I1 | 23 | GND IO | 22 | A2 | A1 | A0 | 21 | 20 | 19 | 18 | 17 | 16 | 13 | I1.0 | I1.1 | I1.2 | I1.3 | 12 | +5V IO | 06 | I2.7 | I2.6 | I2.5 | I2.4 | A2 | A1 | A0 | A0 | A1 | A2 | Int I2 | GND IO | A2 | A1 | A0 | O1.0 | O1.1 | O1.2 | O1.3 | O2.0 | O2.1 | O2.2 | O2.3 | I2.0 | I2.1 | I2.2 | I2.3 | 1-Wire | GND | +3,3V | +5V IO | HomePi IO-Board / Rev 2016/08 / (c) Peter Müller